# EAGLE design mysz (EAGLE 9.2.2)

## Sheet 1 of 5: uC
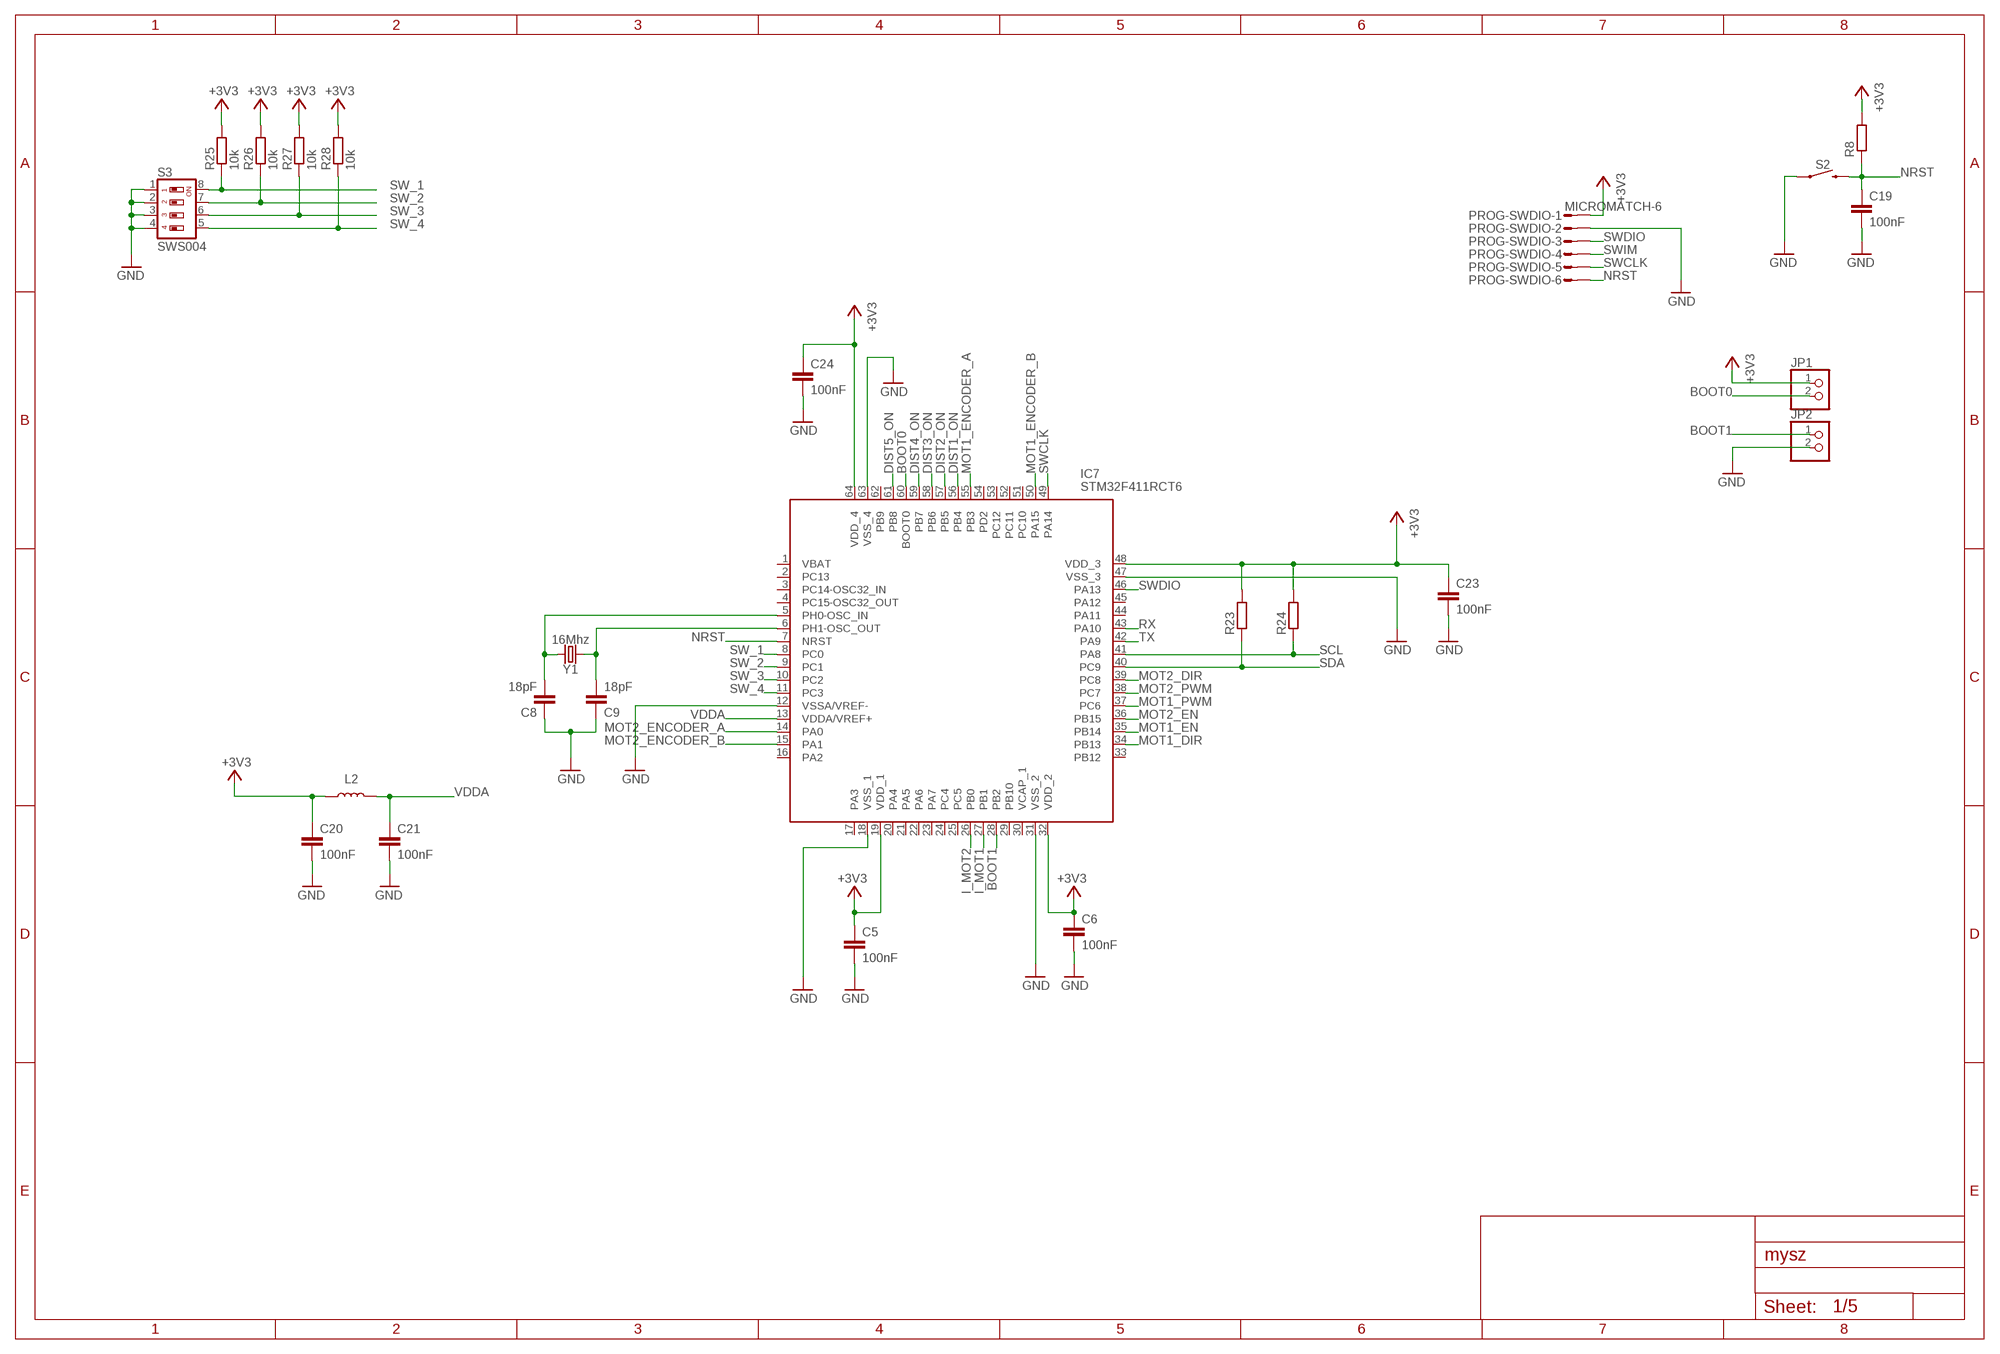
[diagram p0: schematic, sheet 1]

### Parts
C5  100nF  CAPACITOR_SMD_0603  [C0603K]
C6  100nF  CAPACITOR_SMD_0603  [C0603K]
C8  18pF  CAPACITOR_SMD_0603  [C0603K]
C9  18pF  CAPACITOR_SMD_0603  [C0603K]
C19  100nF  CAPACITOR_SMD_0603  [C0603K]
C20  100nF  CAPACITOR_SMD_0603  [C0603K]
C21  100nF  CAPACITOR_SMD_0603  [C0603K]
C23  100nF  CAPACITOR_SMD_0603  [C0603K]
C24  100nF  CAPACITOR_SMD_0603  [C0603K]
IC7  STM32F411RCT6  [QFP50P1200X1200X160-64N]
JP1  PINHD-1X2  [1X02]
JP2  PINHD-1X2  [1X02]
L2  INDUCTOR-0603  [R0603]
PROG-SWDIO  MICROMATCH-6  [MICROMATCH-6]
R8  RESISTOR_SMD_0603  [R0603]
R23  RESISTOR_SMD_0603  [R0603]
R24  RESISTOR_SMD_0603  [R0603]
R25  10k  RESISTOR_SMD_0603  [R0603]
R26  10k  RESISTOR_SMD_0603  [R0603]
R27  10k  RESISTOR_SMD_0603  [R0603]
R28  10k  RESISTOR_SMD_0603  [R0603]
S2  MOMENTARY-SWITCH-SPST-SMD-6.2MM_TALL  [TACTILE_SWITCH_SMD_6.2MM_TALL]
S3  SWS004  [SMS-004]
Y1  16Mhz  CRYSTAL_SMALL"  [CRYSTAL-SMD-5X3.2-4PAD]

### Nets
+3V3: C5.1 C6.1 C20.1 C23.1 C24.1 IC7.19(VDD_1) IC7.32(VDD_2) IC7.48(VDD_3) IC7.64(VDD_4) JP1.1 L2.1 PROG-SWDIO.1 R8.2 R23.2 R24.2 R25.2 R26.2 R27.2 R28.2 ; also sheet 2,3,4
BOOT0: IC7.60(BOOT0) JP1.2
BOOT1: IC7.28(PB2) JP2.1
DIST1_ON: IC7.56(PB4) ; also sheet 4
DIST2_ON: IC7.57(PB5) ; also sheet 4
DIST3_ON: IC7.58(PB6) ; also sheet 4
DIST4_ON: IC7.59(PB7) ; also sheet 4
DIST5_ON: IC7.61(PB8) ; also sheet 4
GND: C5.2 C6.2 C8.1 C9.1 C19.2 C20.2 C21.2 C23.2 C24.2 IC7.12(VSSA/VREF-) IC7.18(VSS_1) IC7.31(VSS_2) IC7.47(VSS_3) IC7.63(VSS_4) JP2.2 PROG-SWDIO.2 S2.A1 S2.A2 S3.1 S3.2 S3.3 S3.4 ; also sheet 2,3,4
I_MOT1: IC7.27(PB1) ; also sheet 3
I_MOT2: IC7.26(PB0) ; also sheet 3
MOT1_DIR: IC7.34(PB13) ; also sheet 3
MOT1_EN: IC7.35(PB14) ; also sheet 3
MOT1_ENCODER_A: IC7.55(PB3) ; also sheet 4
MOT1_ENCODER_B: IC7.50(PA15) ; also sheet 4
MOT1_PWM: IC7.37(PC6) ; also sheet 3
MOT2_DIR: IC7.39(PC8) ; also sheet 3
MOT2_EN: IC7.36(PB15) ; also sheet 3
MOT2_ENCODER_A: IC7.14(PA0) ; also sheet 4
MOT2_ENCODER_B: IC7.15(PA1) ; also sheet 4
MOT2_PWM: IC7.38(PC7) ; also sheet 3
NRST: C19.1 IC7.7(NRST) PROG-SWDIO.6 R8.1 S2.B1 S2.B2
RCC_OSC_IN: C8.2 IC7.5(PH0-OSC_IN) Y1.3
RCC_OSC_OUT: C9.2 IC7.6(PH1-OSC_OUT) Y1.1
RX: IC7.43(PA10)
SCL: IC7.41(PA8) R24.1 ; also sheet 4
SDA: IC7.40(PC9) R23.1 ; also sheet 4
SW_1: IC7.8(PC0) R25.1 S3.8
SW_2: IC7.9(PC1) R26.1 S3.7
SW_3: IC7.10(PC2) R27.1 S3.6
SW_4: IC7.11(PC3) R28.1 S3.5
SWCLK: IC7.49(PA14) PROG-SWDIO.5
SWDIO: IC7.46(PA13) PROG-SWDIO.3
SWIM: PROG-SWDIO.4
TX: IC7.42(PA9)
VDDA: C21.1 IC7.13(VDDA/VREF+) L2.2
Unconnected: IC7.1(VBAT) IC7.2(PC13) IC7.3(PC14-OSC32_IN) IC7.4(PC15-OSC32_OUT) IC7.16(PA2) IC7.17(PA3) IC7.20(PA4) IC7.21(PA5) IC7.22(PA6) IC7.23(PA7) IC7.24(PC4) IC7.25(PC5) IC7.29(PB10) IC7.30(VCAP_1) IC7.33(PB12) IC7.44(PA11) IC7.45(PA12) IC7.51(PC10) IC7.52(PC11) IC7.53(PC12) IC7.54(PD2) IC7.62(PB9)

## Sheet 2 of 5: Power
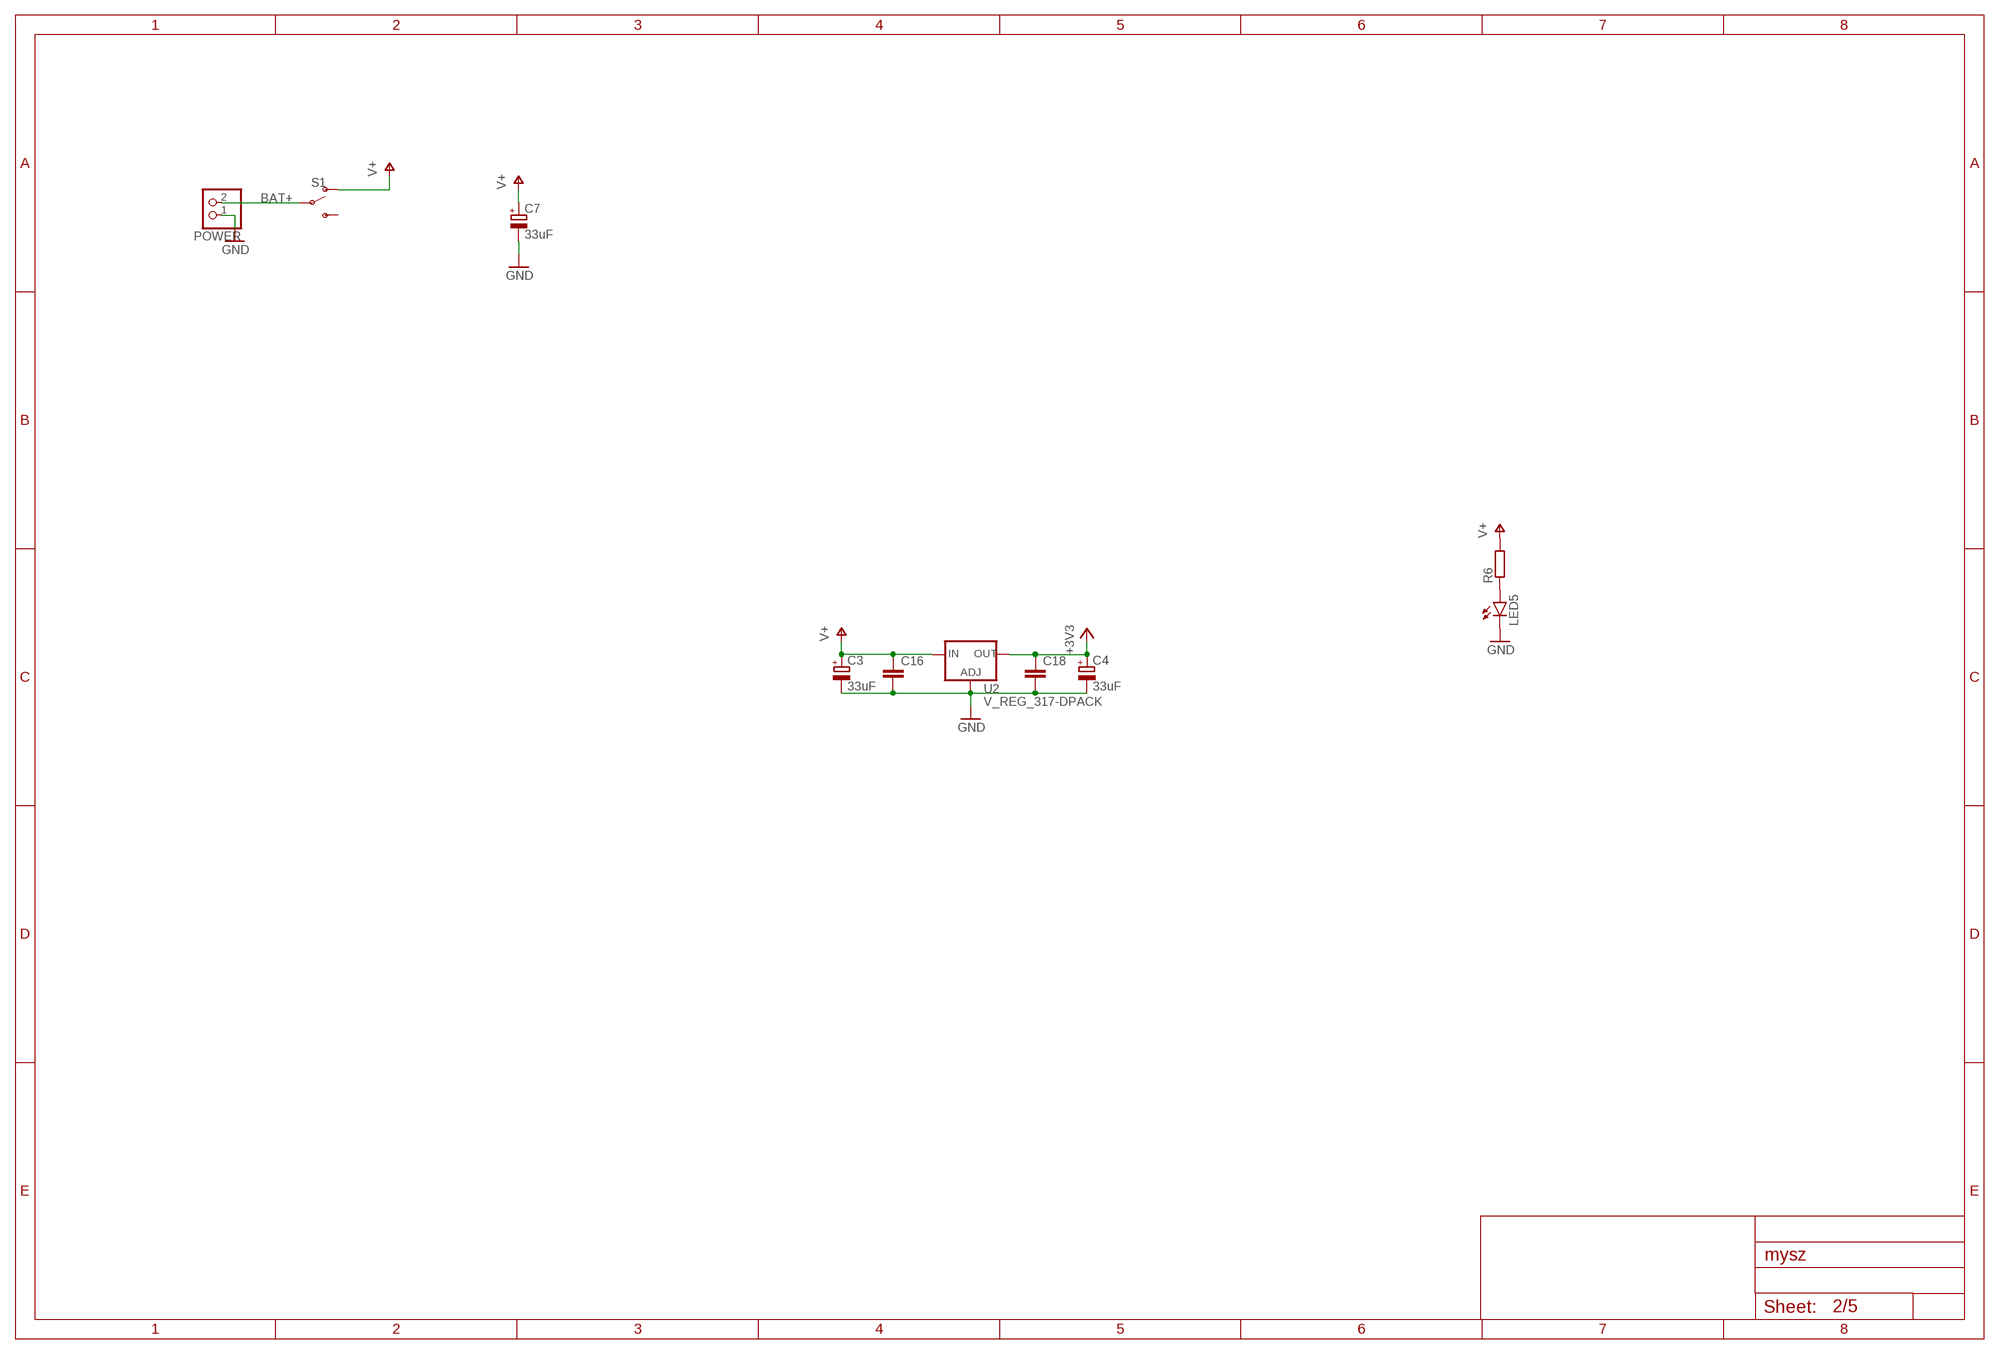
[diagram p1: schematic, sheet 2]

### Parts
C3  33uF  CPOL-EUC  [PANASONIC_C]
C4  33uF  CPOL-EUC  [PANASONIC_C]
C7  33uF  CPOL-EUC  [PANASONIC_C]
C16  CAPACITOR_SMD_0603  [C0603K]
C18  CAPACITOR_SMD_0603  [C0603K]
LED5  LEDCHIPLED_0603  [CHIPLED_0603]
POWER  PINHD-1X2  [1X02]
R6  RESISTOR_SMD_0603  [R0603]
S1  SWITCH-SPDT-PTH-11.6X4.0MM  [SWITCH_SPDT_PTH_11.6X4.0MM]
U2  V_REG_317-DPACK  [V-REG_DPACK]

### Nets
+3V3: C4.+ C18.1 U2.4(OUT) ; also sheet 1,3,4
BAT+: POWER.2 S1.2(P)
GND: C3.- C4.- C7.- C16.2 C18.2 LED5.C POWER.1 U2.1(ADJ) ; also sheet 1,3,4
N$7: LED5.A R6.1
V+: C3.+ C7.+ C16.1 R6.2 S1.1(O) U2.3(IN) ; also sheet 3
Unconnected: S1.3(S)

## Sheet 3 of 5: Motors
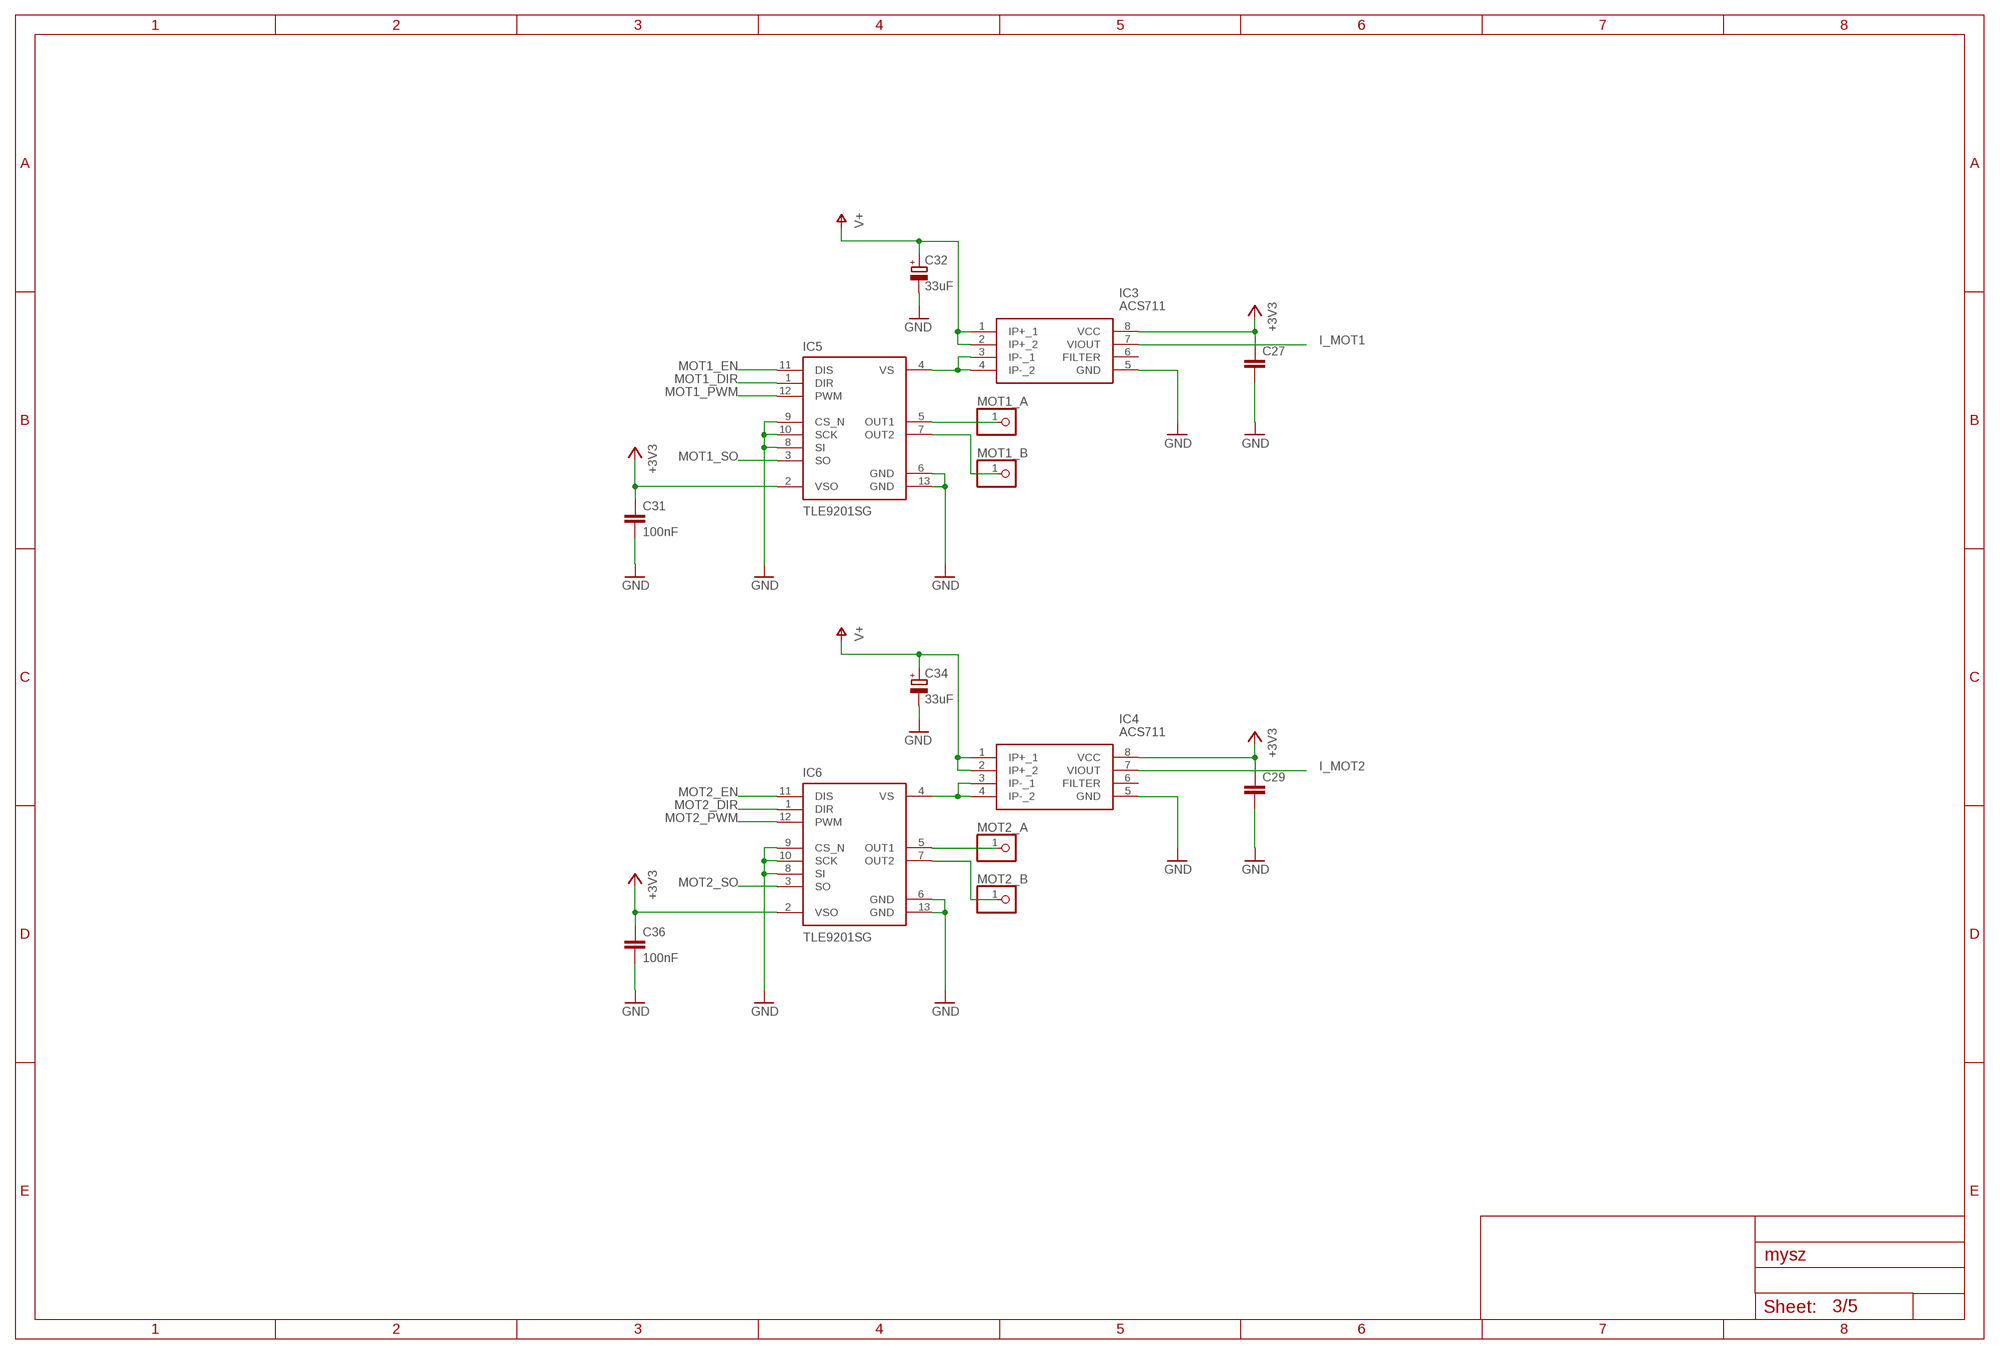
[diagram p2: schematic, sheet 3]

### Parts
C27  CAPACITOR_SMD_0603  [C0603K]
C29  CAPACITOR_SMD_0603  [C0603K]
C31  100nF  CAPACITOR_SMD_0603  [C0603K]
C32  33uF  CPOL-EUC  [PANASONIC_C]
C34  33uF  CPOL-EUC  [PANASONIC_C]
C36  100nF  CAPACITOR_SMD_0603  [C0603K]
IC3  ACS711  ACS712  [SOIC127P600X175-8N]
IC4  ACS711  ACS712  [SOIC127P600X175-8N]
IC5  TLE9201SG  [PG-DSO-12-9]
IC6  TLE9201SG  [PG-DSO-12-9]
MOT1_A  PINHD-1X1  [1X01]
MOT1_B  PINHD-1X1  [1X01]
MOT2_A  PINHD-1X1  [1X01]
MOT2_B  PINHD-1X1  [1X01]

### Nets
+3V3: C27.1 C29.1 C31.1 C36.1 IC3.8(VCC) IC4.8(VCC) IC5.2(VSO) IC6.2(VSO) ; also sheet 1,2,4
GND: C27.2 C29.2 C31.2 C32.- C34.- C36.2 IC3.5(GND) IC4.5(GND) IC5.6(GND) IC5.8(SI) IC5.9(CS_N) IC5.10(SCK) IC5.13(GND) IC6.6(GND) IC6.8(SI) IC6.9(CS_N) IC6.10(SCK) IC6.13(GND) ; also sheet 1,2,4
I_MOT1: IC3.7(VIOUT) ; also sheet 1
I_MOT2: IC4.7(VIOUT) ; also sheet 1
MOT1_A: IC5.5(OUT1) MOT1_A.1
MOT1_B: IC5.7(OUT2) MOT1_B.1
MOT1_DIR: IC5.1(DIR) ; also sheet 1
MOT1_EN: IC5.11(DIS) ; also sheet 1
MOT1_PWM: IC5.12(PWM) ; also sheet 1
MOT1_SO: IC5.3(SO)
MOT1_VS: IC3.3(IP-_1) IC3.4(IP-_2) IC5.4(VS)
MOT2_A: IC6.5(OUT1) MOT2_A.1
MOT2_B: IC6.7(OUT2) MOT2_B.1
MOT2_DIR: IC6.1(DIR) ; also sheet 1
MOT2_EN: IC6.11(DIS) ; also sheet 1
MOT2_PWM: IC6.12(PWM) ; also sheet 1
MOT2_SO: IC6.3(SO)
MOT2_VS: IC4.3(IP-_1) IC4.4(IP-_2) IC6.4(VS)
V+: C32.+ C34.+ IC3.1(IP+_1) IC3.2(IP+_2) IC4.1(IP+_1) IC4.2(IP+_2) ; also sheet 2
Unconnected: IC3.6(FILTER) IC4.6(FILTER)

## Sheet 4 of 5: Sensors
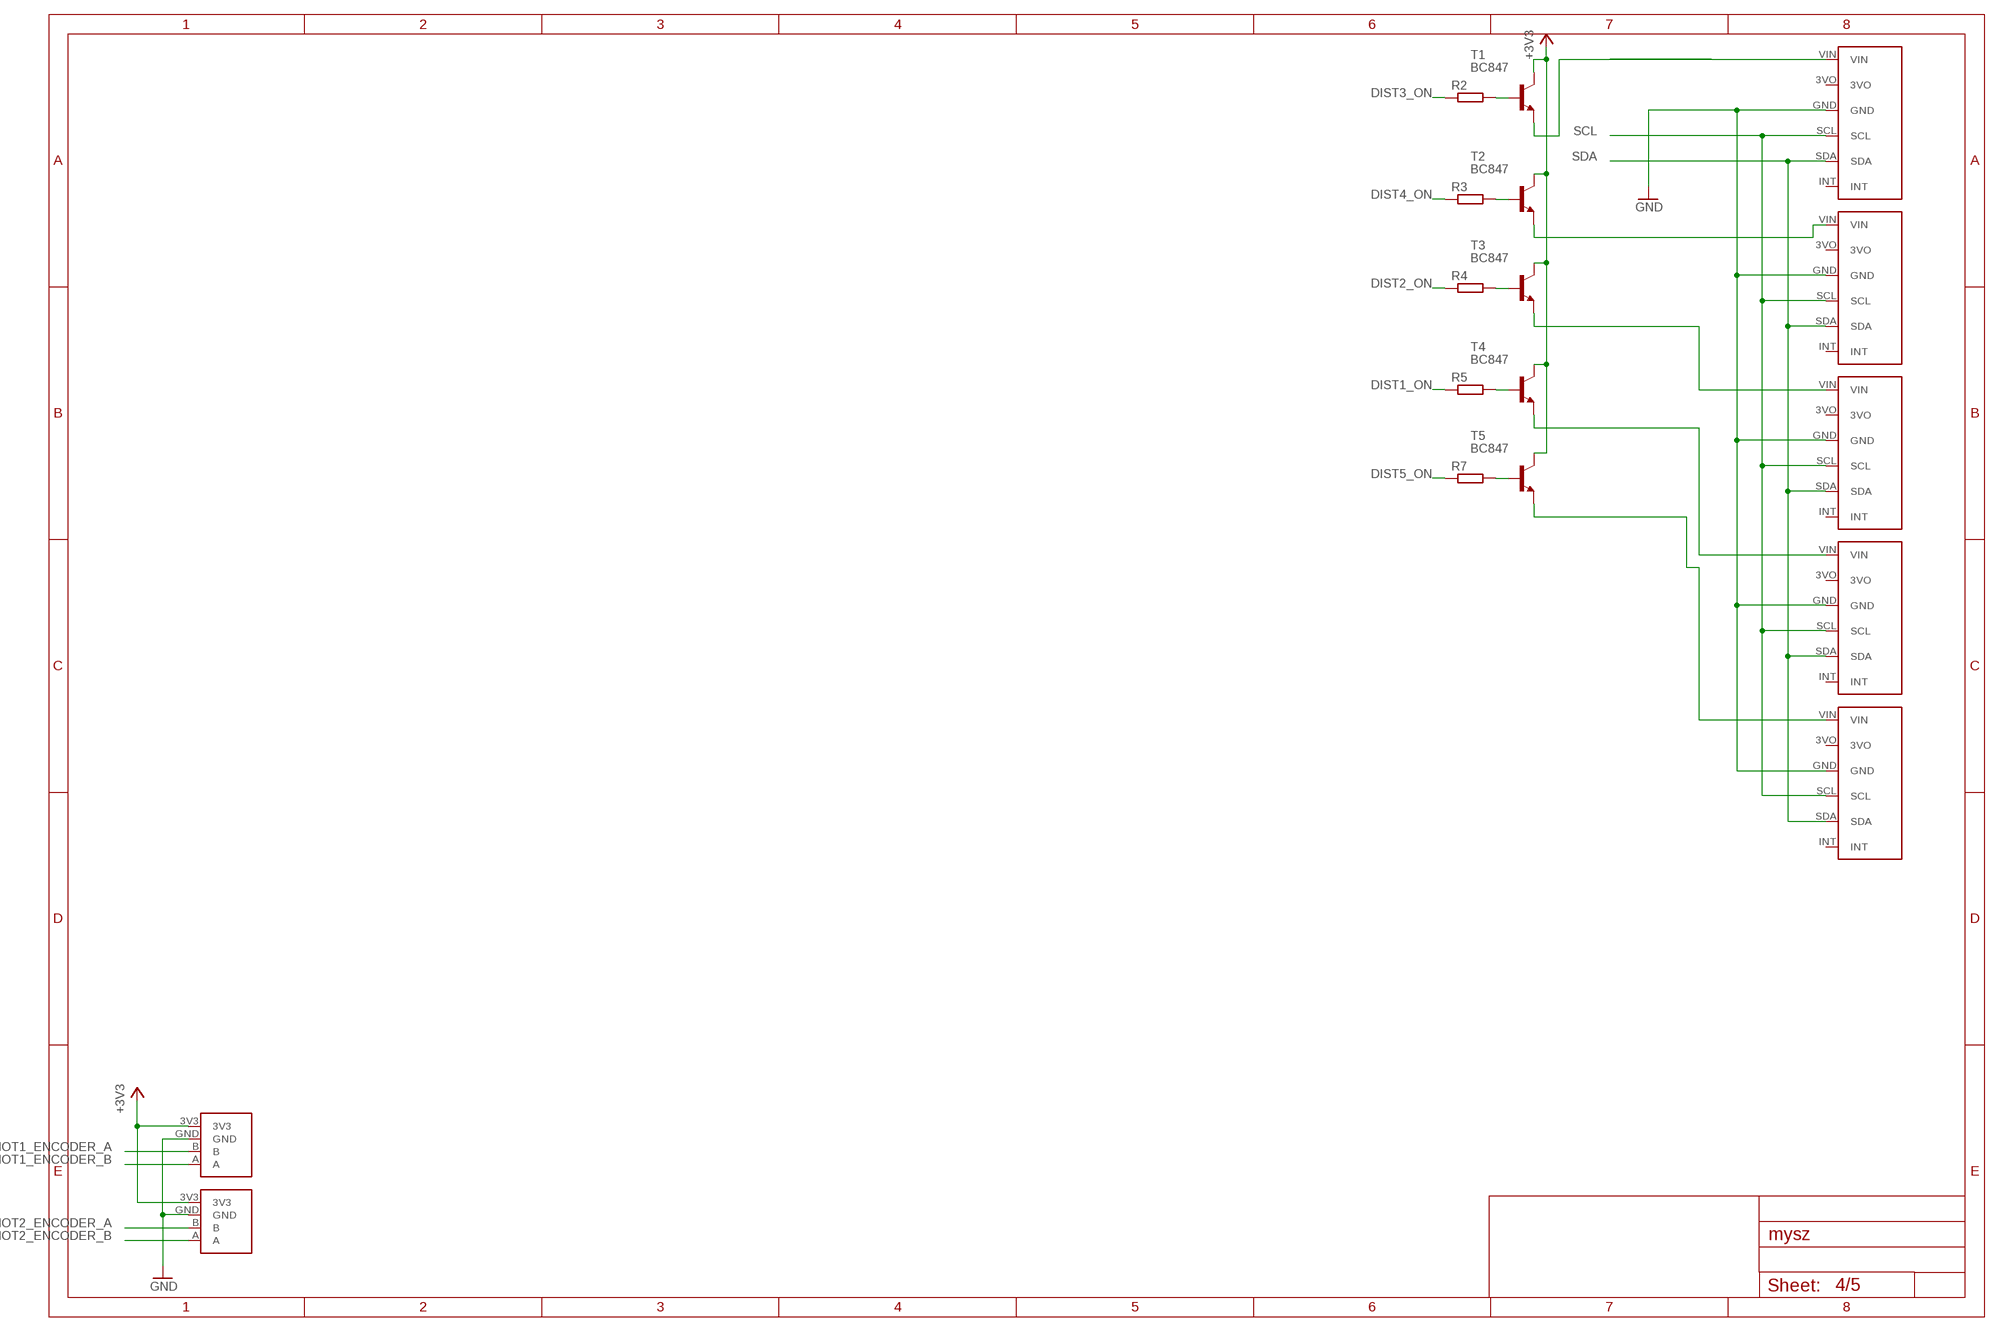
[diagram p3: schematic, sheet 4]

### Parts
R2  RESISTOR_SMD_0603  [R0603]
R3  RESISTOR_SMD_0603  [R0603]
R4  RESISTOR_SMD_0603  [R0603]
R5  RESISTOR_SMD_0603  [R0603]
R7  RESISTOR_SMD_0603  [R0603]
T1  BC847  [SOT23]
T2  BC847  [SOT23]
T3  BC847  [SOT23]
T4  BC847  [SOT23]
T5  BC847  [SOT23]
U$7  ADAFRUIT-VCNL4010  [ADAFRUIT-VCNL4010]
U$8  ADAFRUIT-VCNL4010  [ADAFRUIT-VCNL4010]
U$9  ADAFRUIT-VCNL4010  [ADAFRUIT-VCNL4010]
U$10  ADAFRUIT-VCNL4010  [ADAFRUIT-VCNL4010]
U$11  ADAFRUIT-VCNL4010  [ADAFRUIT-VCNL4010]
U$13  PRIV-AS5040  [PRIV-AS5040]
U$14  PRIV-AS5040  [PRIV-AS5040]

### Nets
+3V3: T1.3(C) T2.3(C) T3.3(C) T4.3(C) T5.3(C) U$13.3V3 U$14.3V3 ; also sheet 1,2,3
DIST1_ON: R5.1 ; also sheet 1
DIST2_ON: R4.1 ; also sheet 1
DIST3_ON: R2.1 ; also sheet 1
DIST4_ON: R3.1 ; also sheet 1
DIST5_ON: R7.1 ; also sheet 1
GND: U$7.GND U$8.GND U$9.GND U$10.GND U$11.GND U$13.GND U$14.GND ; also sheet 1,2,3
MOT1_ENCODER_A: U$14.B ; also sheet 1
MOT1_ENCODER_B: U$14.A ; also sheet 1
MOT2_ENCODER_A: U$13.B ; also sheet 1
MOT2_ENCODER_B: U$13.A ; also sheet 1
N$2: R2.2 T1.1(B)
N$3: R3.2 T2.1(B)
N$4: R4.2 T3.1(B)
N$5: R5.2 T4.1(B)
N$6: R7.2 T5.1(B)
N$8: T2.2(E) U$8.VIN
N$9: T1.2(E) U$7.VIN
N$11: T3.2(E) U$9.VIN
N$12: T4.2(E) U$10.VIN
N$13: T5.2(E) U$11.VIN
SCL: U$7.SCL U$8.SCL U$9.SCL U$10.SCL U$11.SCL ; also sheet 1
SDA: U$7.SDA U$8.SDA U$9.SDA U$10.SDA U$11.SDA ; also sheet 1
Unconnected: U$7.3VO U$7.INT U$8.3VO U$8.INT U$9.3VO U$9.INT U$10.3VO U$10.INT U$11.3VO U$11.INT

## Sheet 5 of 5: Display and bluetooth
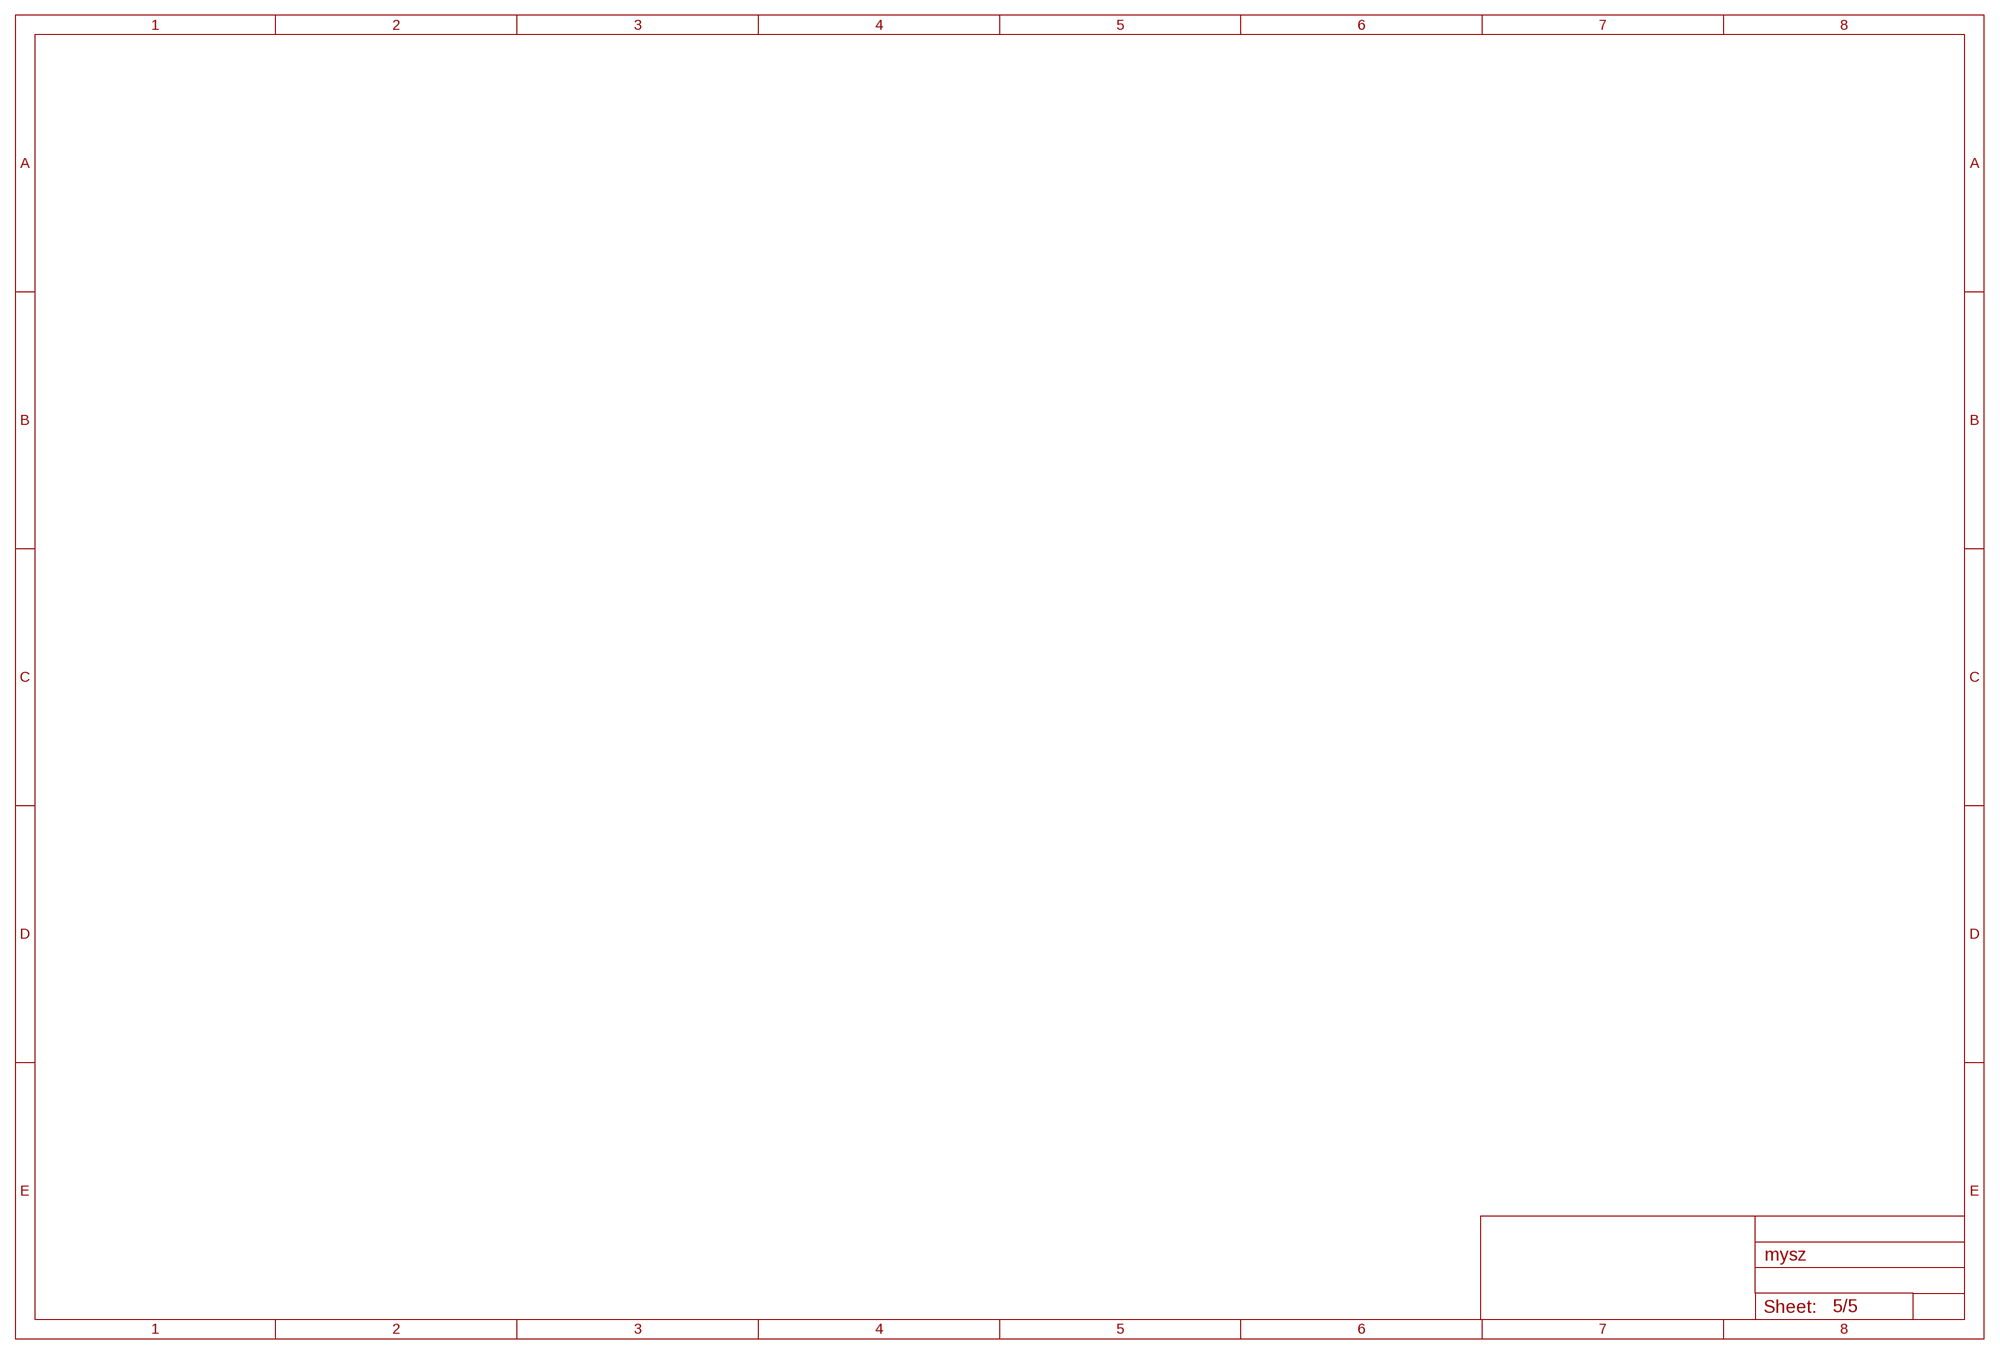
[diagram p4: schematic, sheet 5]

## Library data of the parts
C3 C4 C7 C32 C34 = Kell Ideas:CPOL-EU: POLARIZED CAPACITOR, European symbol; SPICEPREFIX: C
C5 C6 C8 C9 C16 C18-C21 C23 C24 C27 C29 C31 C36 = Kell Ideas:CAPACITOR_SMD
IC3 IC4 = Kell Ideas:ACS712: Fully Integrated, Hall Effect-Based Linear Current Sensor IC with 2.1 kVRMS Isolation and a Low-Resistance Current Conductor Source: Datasheet; ARROW_PART_NUMBER: ACS712; DESCRIPTION: Fully Integrated, Hall Effect-Based Linear Current Sensor IC with 2.1 kVRMS Isolation and a Low-Resistance Current Conductor; HEIGHT: 1.75mm; MANUFACTURER_NAME: Allegro Microsystems; MANUFACTURER_PART_NUMBER: ACS712
IC5 IC6 = Kell Ideas:TLE9201SG: Infineon TLE9201SG, BLDC Motor Driver IC, 28 V 6A 12-Pin, DSO-12-17 Source: Datasheet; ARROW_PART_NUMBER: TLE9201SG; ARROW_PRICE/STOCK: http://uk.rs-online.com/web/p/products/1661194; DESCRIPTION: Infineon TLE9201SG, BLDC Motor Driver IC, 28 V 6A 12-Pin, DSO-12-17; HEIGHT: mm; MANUFACTURER_NAME: Infineon; MANUFACTURER_PART_NUMBER: TLE9201SG; RS_PART_NUMBER: 1661194; RS_PRICE/STOCK: http://uk.rs-online.com/web/p/products/1661194
IC7 = Kell Ideas:STM32F411RCT6: STMICROELECTRONICS - STM32F411RCT6 - MCU, 32BIT, CORTEX-M4, 100MHZ, LQFP-64 Source: Datasheet; ARROW_PART_NUMBER: STM32F411RCT6; ARROW_PRICE-STOCK: https://www.arrow.com/en/products/stm32f411rct6/stmicroelectronics; DESCRIPTION: STMICROELECTRONICS - STM32F411RCT6 - MCU, 32BIT, CORTEX-M4, 100MHZ, LQFP-64; HEIGHT: 1.6mm; MANUFACTURER_NAME: STMicroelectronics; MANUFACTURER_PART_NUMBER: STM32F411RCT6
JP1 JP2 POWER = pinhead:PINHD-1X2: PIN HEADER
L2 = Kell Ideas:INDUCTOR: Inductors Resist changes in electrical current. Basically a coil of wire. SparkFun Products: SparkFun Load Cell Amplifier - HX711 IOIO-OTG - V2.2
LED5 = led:LED: LED OSRAM: - CHIPLED LG R971, LG N971, LY N971, LG Q971, LY Q971, LO R971, LY R971 LH N974, LH R974 LS Q976, LO Q976, LY Q976 LO Q996 - Hyper CHIPLED LW Q18S LB Q993, LB Q99A, LB R99A - SideLED LS A670, LO A670, LY A670, LG A670, LP A670 LB A673, LV A673, LT A673, LW A673 LH A674 LY A675 LS A676, LA A676, LO A676, LY A676, LW A676 LS A679, LY A679, LG A679 - Hyper Micro SIDELED® LS Y876, LA Y876, LO Y876, LY Y876 LT Y87S - SmartLED LW L88C, LW L88S LB L89C, LB L89S, LG L890 LS L89K, LO L89K, LY L89K LS L896, LA L896, LO L896, LY L896 - TOPLED LS T670, LO T670, LY T670, LG T670, LP T670 LSG T670, LSP T670, LSY T670, LOP T670, LYG T670 LG T671, LOG T671, LSG T671 LB T673, LV T673, LT T673, LW T673 LH T674 LS T676, LA T676, LO T676, LY T676, LB T676, LH T676, LSB T676, LW T676 LB T67C, LV T67C, LT T67C, LS T67K, LO T67K, LY T67K, LW E67C LS E67B, LA E67B, LO E67B, LY E67B, LB E67C, LV E67C, LT E67C LW T67C LS T679, LY T679, LG T679 LS T770, LO T770, LY T770, LG T770, LP T770 LB T773, LV T773, LT T773, LW T773 LH T774 LS E675, LA E675, LY E675, LS T675 LS T776, LA T776, LO T776, LY T776, LB T776 LHGB T686 LT T68C, LB T68C - Hyper Mini TOPLED® LB M676 - Mini TOPLED Santana® LG M470 LS M47K, LO M47K, LY M47K Source: http://www.osram.convergy.de LUXEON: - LUMILED® LXK2-PW12-R00, LXK2-PW12-S00, LXK2-PW14-U00, LXK2-PW14-V00 LXK2-PM12-R00, LXK2-PM12-S00, LXK2-PM14-U00 LXK2-PE12-Q00, LXK2-PE12-R00, LXK2-PE12-S00, LXK2-PE14-T00, LXK2-PE14-U00 LXK2-PB12-K00, LXK2-PB12-L00, LXK2-PB12-M00, LXK2-PB14-N00, LXK2-PB14-P00, LXK2-PB14-Q00 LXK2-PR12-L00, LXK2-PR12-M00, LXK2-PR14-Q00, LXK2-PR14-R00 LXK2-PD12-Q00, LXK2-PD12-R00, LXK2-PD12-S00 LXK2-PH12-R00, LXK2-PH12-S00 LXK2-PL12-P00, LXK2-PL12-Q00, LXK2-PL12-R00 Source: www.luxeon.com KINGBRIGHT: KA-3528ASYC Source: www.kingbright.com
MOT1_A MOT1_B MOT2_A MOT2_B = pinhead:PINHD-1X1: PIN HEADER
PROG-SWDIO = con-amp-micromatch:MICROMATCH-6: MicroMaTch 6 7-215464-6 / 0-215464-6 Drawing Number C-215464 DDEController.pdf; MPN: 7-215464-6; OC_FARNELL: 3784630; OC_NEWARK: 19R8125
R2-R8 R23-R28 = Kell Ideas:RESISTOR_SMD
S1 = SparkFun-Switches:SWITCH-SPDT: Single Pole, Double Throw (SPDT) Switch Single-pole, double-throw (SPDT) switch. Variant Overview SMD-AYZ0202 Surface Mount DPDT Switch (COM-00597) Used on e.g. LilyPad Arduino USB - ATmega32U4 Board PTH-11.6X4.0MM SPDT Mini Power Switch (COM-00102) Used on e.g. SparkFun Simon Says - Through-Hole Soldering Kit (KIT-10547) PTH-11.6X4.0MM-KIT KIT version of SPDT Mini Power Switch - Simplifies soldering by removing tStop of switch pins - only one side can be soldered. PTH-11.6X4.0MM-LOCK LOCK version of SPDT Mini Power Switch - Offset pins hold switch in place for easier soldering. SMD-RIGHT-ANGLE Surface Mount Right Angle Switch (COM-10860) Used on e.g. SparkFun ESP8266 Thing; PROD_ID: SWCH-08261; SF_SKU: COM-00102
S2 = Kell Ideas:MOMENTARY-SWITCH-SPST: Momentary Switch (Pushbutton) - SPST Normally-open (NO) SPST momentary switches (buttons, pushbuttons). Variants PTH-12MM - 12mm square, through-hole Momentary Pushbutton Switch - 12mm Square (COM-09190) PTH-6.0MM, PTH-6.0MM-KIT - 6.0mm square, through-hole Mini Pushbutton Switch (COM-00097) KIT package intended for soldering kit's - only one side of pads' copper is exposed. PTH-RIGHT-ANGLE-KIT - Right-angle, through-hole Right Angle Tactile Button - Used on SparkFun BigTime Watch Kit SMD-12MM - 12mm square, surface-mount Tactile Button - SMD (12mm) (COM-12993) Used on SparkFun PicoBoard SMD-4.5MM - 4.5mm Square Trackball Switch Used on SparkFun Blackberry Trackballer Breakout SMD-4.6MMX2.8MM - 4.60mm x 2.80mm, surface mount Used on SparkFun SAMD21 Mini Breakout SMD-5.2MM, SMD-5.2-REDUNDANT - 5.2mm square, surface-mount Mini Pushbutton Switch - SMD (COM-08720) Used on Arduino Pro Mini REDUNDANT package connects both switch circuits together SMD-6.0X3.5MM - 6.0 x 3.5mm, surface mount Momentary Reset Switch SMD (COM-08229) SMD-6.2MM-TALL - 6.2mm square, surface mount Tactile Button - SMD (6mm) Used on SparkFun Digital Sandbox SMD-RIGHT-ANGLE - Right-angle, surface mount Used on SparkFun Block for Intel® Edison - Arduino
S3 = Kell Ideas:SWS004: SMD Dip Switch 4 pol.
T1-T5 = transistor:BC847: NPN TRANSISTOR
U2 = Kell Ideas:V_REG_317: Voltage Regulator Standard LM317 adjustable voltage regulator. AOI (Adjust Output Input). Google 'LM317 Calculator' for easy to use app to get the two resistor values needed. 240/720 for 5V output. 240/390 for 3.3V output. Spark Fun Electronics SKU : COM-00527
U$7-U$11 = Kell Ideas:ADAFRUIT-VCNL4010
U$13 U$14 = Kell Ideas:PRIV-AS5040
Y1 = Kell Ideas:CRYSTAL_SMALL: 12.0MHz Crystal Frequency: 12.0MHz Frequency Tolerance: ±20ppm Load Capacitance: 18pF SparkFun Products: SparkFun Logomatic <https://www.sparkfun.com/products/12772> Pocket AVR Programmer <https://www.sparkfun.com/products/9825>; PROD_ID: XTAL-08297; VALUE: 12MHz

## Board
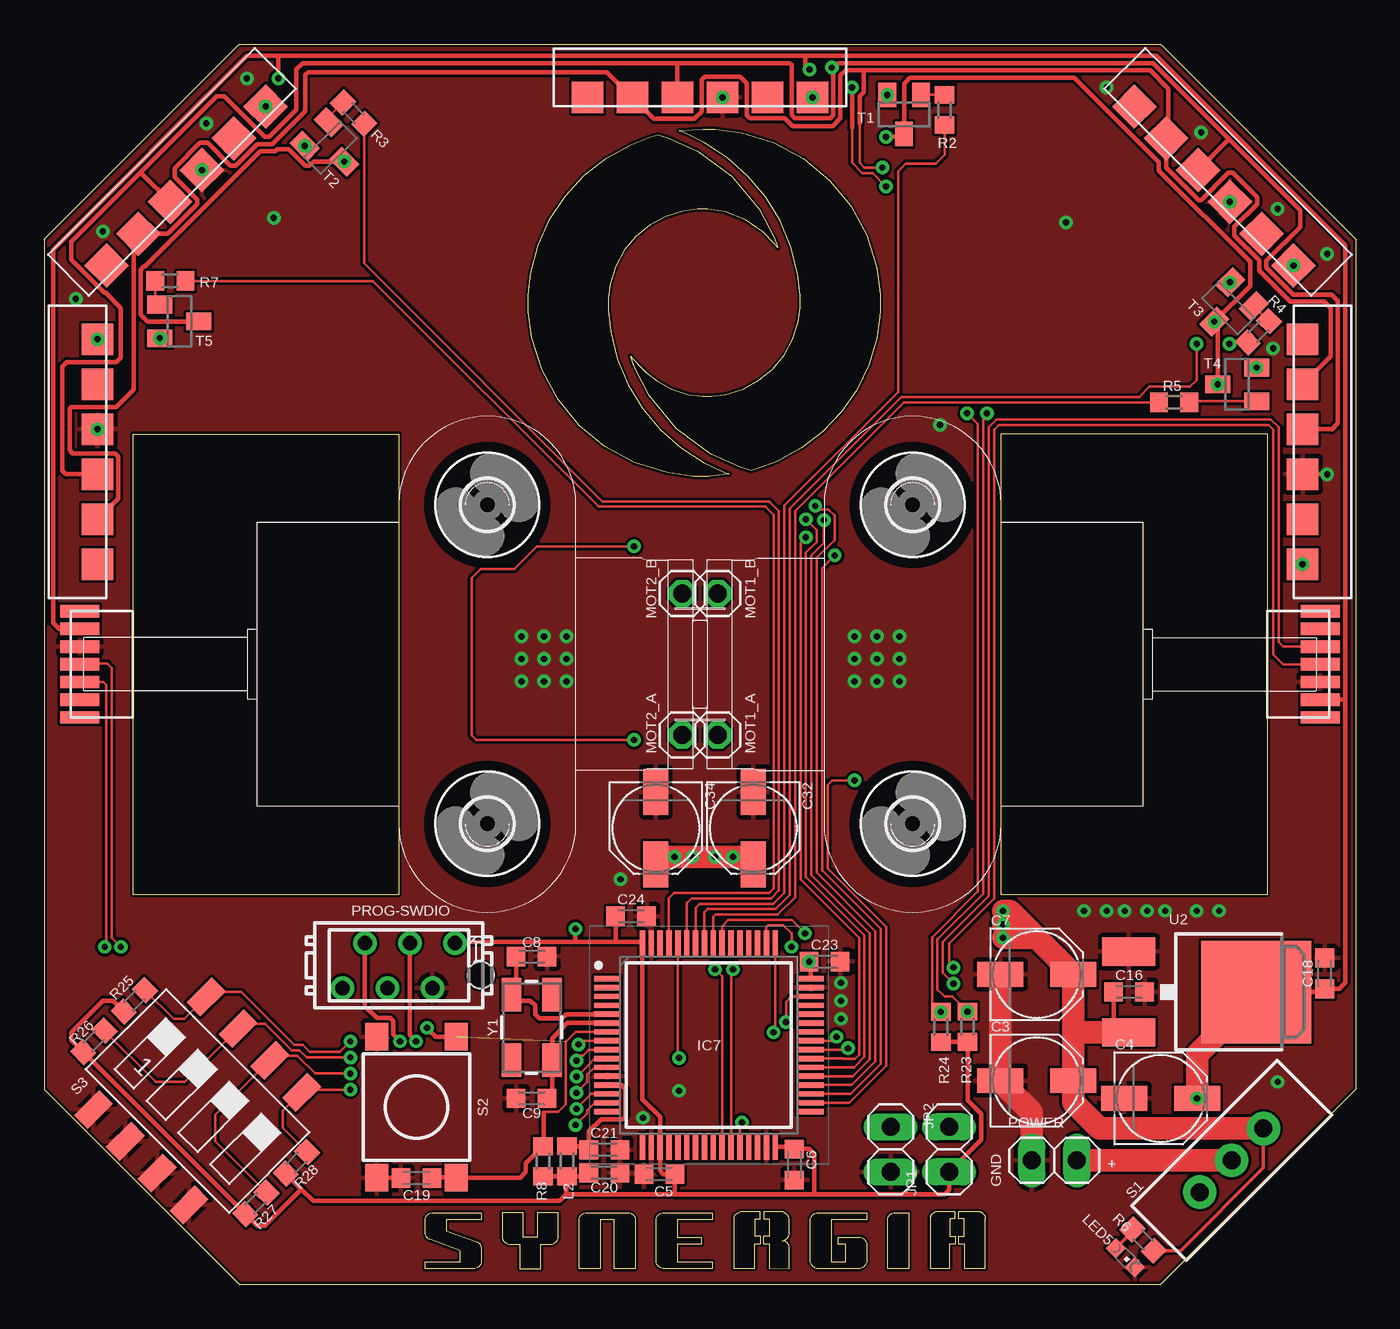
[diagram p5: board, top side]
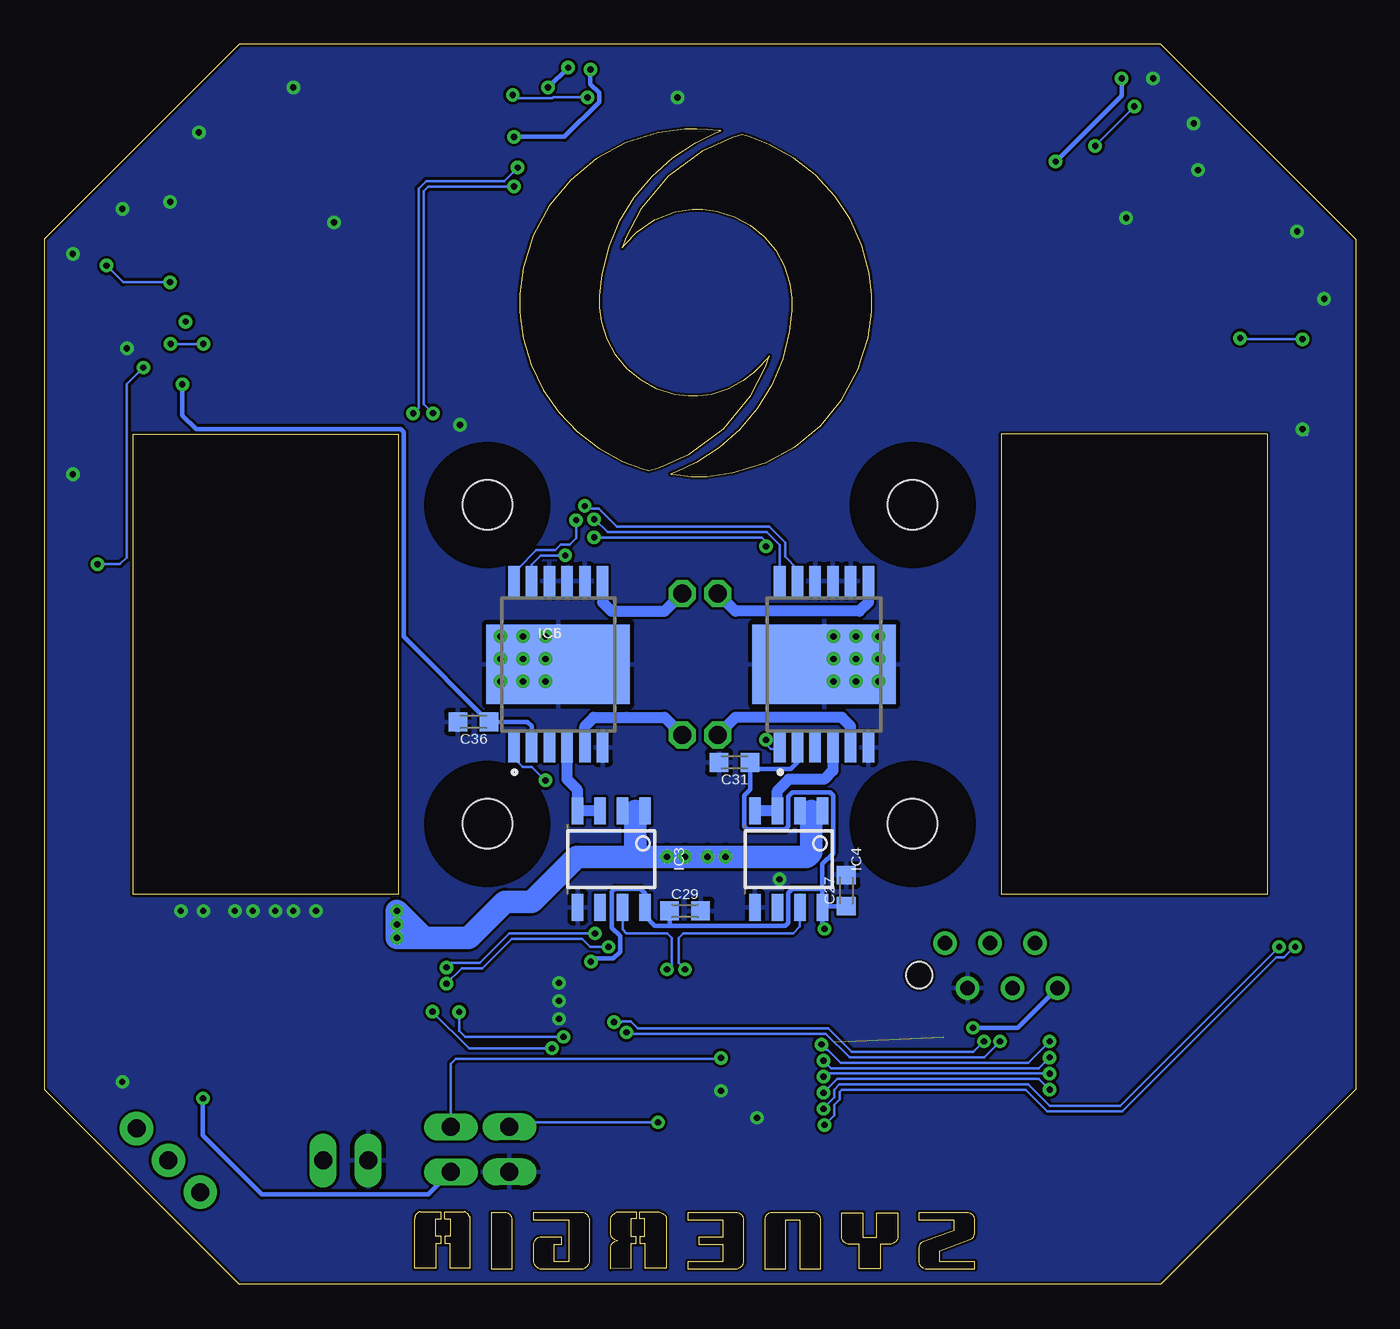
[diagram p6: board, bottom side, seen from below]

Size 74 x 70 mm. Coordinates in mm from the lower left corner, seen from the top.
Outline: 311 segments
Copper layers (1*16): Top 0.035mm / dielectric 1.5mm / Bottom 0.035mm
Design rules "default *": minimum track width 6mil, minimum drill 0.35mm, track to track 6mil, track to pad 6mil, pad to pad 6mil, via to via 6mil, smd to smd 6mil, copper to edge 6mil, drill to drill 6mil, minimum pad ring 10mil, minimum via ring 8mil, stop-mask expansion 4mil, vias tented up to drill 15mil, thermal gap 10mil

### Footprints (pad centres in the part's own frame; a part is rotated, then mirrored left to right if it is on the bottom)
PANASONIC_C = smd 2.6 x 1.4: + 2.05,0; - -2.05,0
C0603K = smd 1.05 x 1.08: 1 -0.875,0; 2 0.875,0
SOIC127P600X175-8N = smd 1.525 x 0.65: 1 -2.712,1.905; 2 -2.712,0.635; 3 -2.712,-0.635; 4 -2.712,-1.905; 5 2.712,-1.905; 6 2.712,-0.635; 7 2.712,0.635; 8 2.712,1.905
PG-DSO-12-9 = smd 0.65 x 1.67: 1 -2.5,-4.7; 2 -1.5,-4.7; 3 -0.5,-4.7; 4 0.5,-4.7; 5 1.5,-4.7; 6 2.5,-4.7; 7 2.5,4.7; 8 1.5,4.7; 9 0.5,4.7; 10 -0.5,4.7; 11 -1.5,4.7; 12 -2.5,4.7 | smd 8.1 x 4.5: 13 0,0
QFP50P1200X1200X160-64N = smd 1.475 x 0.3: 1 -5.738,3.75; 2 -5.738,3.25; 3 -5.738,2.75; 4 -5.738,2.25; 5 -5.738,1.75; 6 -5.738,1.25; 7 -5.738,0.75; 8 -5.738,0.25; 9 -5.738,-0.25; 10 -5.738,-0.75; 11 -5.738,-1.25; 12 -5.738,-1.75; 13 -5.738,-2.25; 14 -5.738,-2.75; 15 -5.738,-3.25; 16 -5.738,-3.75; 33 5.738,-3.75; 34 5.738,-3.25; 35 5.738,-2.75; 36 5.738,-2.25; 37 5.738,-1.75; 38 5.738,-1.25; 39 5.738,-0.75; 40 5.738,-0.25; 41 5.738,0.25; 42 5.738,0.75; 43 5.738,1.25; 44 5.738,1.75; 45 5.738,2.25; 46 5.738,2.75; 47 5.738,3.25; 48 5.738,3.75 | smd 0.3 x 1.475: 17 -3.75,-5.738; 18 -3.25,-5.738; 19 -2.75,-5.738; 20 -2.25,-5.738; 21 -1.75,-5.738; 22 -1.25,-5.738; 23 -0.75,-5.738; 24 -0.25,-5.738; 25 0.25,-5.738; 26 0.75,-5.738; 27 1.25,-5.738; 28 1.75,-5.738; 29 2.25,-5.738; 30 2.75,-5.738; 31 3.25,-5.738; 32 3.75,-5.738; 49 3.75,5.738; 50 3.25,5.738; 51 2.75,5.738; 52 2.25,5.738; 53 1.75,5.738; 54 1.25,5.738; 55 0.75,5.738; 56 0.25,5.738; 57 -0.25,5.738; 58 -0.75,5.738; 59 -1.25,5.738; 60 -1.75,5.738; 61 -2.25,5.738; 62 -2.75,5.738; 63 -3.25,5.738; 64 -3.75,5.738
1X02 = drill 1.016 long: 1 -1.27,0; 2 1.27,0
R0603 = smd 1 x 1.1: 1 -0.85,0; 2 0.85,0
CHIPLED_0603 = smd 0.8 x 0.8: A 0,-0.75; C 0,0.75
1X01 = drill 1.016 octagon: 1 0,0
MICROMATCH-6 = drill 0.813: 1 3.175,1.27; 2 1.905,-1.27; 3 0.635,1.27; 4 -0.635,-1.27; 5 -1.905,1.27; 6 -3.175,-1.27 | hole 1.5: 4.63,-0.55
SWITCH_SPDT_PTH_11.6X4.0MM = drill 1.016 pad 1.88: 1 0,2.54; 2 0,0; 3 0,-2.54
TACTILE_SWITCH_SMD_6.2MM_TALL = smd 1.55 x 1.3: A1 -3.975,-2.25; A2 3.975,-2.25; B1 -3.975,2.25; B2 3.975,2.25
SMS-004 = smd 1.092 x 2.007: 1 -3.81,-4.496; 2 -1.27,-4.496; 3 1.27,-4.496; 4 3.81,-4.496; 5 3.81,4.496; 6 1.27,4.496; 7 -1.27,4.496; 8 -3.81,4.496
SOT23 = smd 1 x 1.4: 1 -0.95,-1.1; 2 0.95,-1.1; 3 0,1.1
V-REG_DPACK = smd 1.6 x 3: 1 -2.28,-4.8; 3 2.28,-4.8 | smd 5.8 x 6.2: 4 0,2.38
2,8 = hole 2.8: 0,0
ADAFRUIT-VCNL4010 = smd 1.778 x 1.778: 3VO 0,3.81; GND 0,1.27; INT 0,-6.35; SCL 0,-1.27; SDA 0,-3.81; VIN 0,6.35
PRIV-AS5040 = smd 2.2 x 0.7: 3V3 0,2; A 0,-1; B 0,0; GND 0,1; P$4 0,3; P$6 0,-2; P$7 0,-3
CRYSTAL-SMD-5X3.2-4PAD = smd 1.9 x 1.1: 1 -1.85,-1.15; 2 1.85,-1.15; 3 1.85,1.15; 4 -1.85,1.15

### Placement (x,y rotation side)
C3  56,11.5 0 top
C4  63,10.5 0 top
C5  34.7,6.21 180 top
C6  42.32,6.76 270 top
C7  56,17.5 0 top
C8  27.5,18.5 180 top
C9  27.5,10.5 0 top
C16  61.21,16.51 0 top
C18  72.25,17.55 90 top
C19  21,6 180 top
C20  31.6,6.3 0 top
C21  31.6,7.6 0 top
C23  44.04,18.22 0 top
C24  33.11,20.78 0 top
C27  28.74,22.22 90 bottom
C29  37.85,21.08 0 bottom
C31  35.05,29.46 180 bottom
C32  40,25.75 270 top
C34  34.5,25.75 270 top
C36  49.78,31.75 180 bottom
IC3  42,24 270 bottom
IC4  32,24 270 bottom
IC5  45,35 0 bottom
IC6  30,35 0 bottom
IC7  37.5,13.5 0 top
JP1  51.05,7.62 90 top
JP2  47.75,7.62 270 top
L2  29.49,6.95 90 top
LED5  61,1.5 225 top
MOT1_A  38,31 0 top
MOT1_B  38,39 0 top
MOT2_A  36,31 0 top
MOT2_B  36,39 0 top
POWER  57,7 0 top
PROG-SWDIO  20,18 0 top
R2  50.8,66.29 90 top
R3  17.45,66.11 135 top
R4  68.51,53.77 45 top
R5  63.75,49.78 0 top
R6  62,2.5 315 top
R7  7.11,56.64 180 top
R8  28.13,6.94 270 top
R23  52.1,14.54 270 top
R24  50.59,14.52 270 top
R25  5.08,16 225 top
R26  2.79,13.72 225 top
R27  11.94,4.57 225 top
R28  14.22,6.86 225 top
S1  67,7 315 top
S2  21,10 270 top
S3  8.65,10.35 315 top
T1  48.51,66.04 180 top
T2  16.15,64.16 225 top
T3  66.8,55.12 135 top
T4  67.31,50.8 90 top
T5  7.62,54.36 270 top
U2  66,16.5 270 top
U$1  [POLOLU_SINGLE_SHAFT]  12,43 270 top
U$2  [POLOLU_SINGLE_SHAFT]  62,27 90 top
U$3  [2,8]  25,44 0 top
U$4  [2,8]  25,26 0 top
U$5  [2,8]  49,26 0 top
U$6  [2,8]  49,44 0 top
U$7  37,67 270 top
U$8  8,62 315 top
U$9  66,62 225 top
U$10  71,47 180 top
U$11  3,47 0 top
U$13  2,35 0 top
U$14  72,35 180 top
Y1  27.5,14.5 90 top

### Tracks (layer width: path | path; a pad name or v marks a point on that pad's centre or on a via)
+3V3  (via drill 0.35)
  Top 0.152: 2.07,13.24 R26.2 | 11.46,3.84 R27.2
  Top 0.254: 13.21,69.34 11.43,69.34 0.51,58.42 0.51,37.34 0.85,37 U$13.3V3 | 13.21,69.34 42.93,69.34 | 42.93,69.34 62.74,69.34 73.41,58.67 73.41,33.02 | U2.4 68.58,16.5 72.07,16.5 C18.1 73.06,16.68 73.41,17.02 73.41,33.02 | PROG-SWDIO.1 23.22,19.32 29.97,19.32 | 32.26,19.32 33.67,19.32 IC7.64 33.75,10.45 34.75,9.45 IC7.19 34.75,6.4 34.93,6.21 C5.1 35.58,5.1 35.56,5.08 | 32.26,19.32 29.97,19.32 | U$14.3V3 73.39,33 73.41,33.02 | C24.1 32.24,19.34 32.26,19.32 | L2.1 30.53,6.1 C20.1 | R8.2 28.14,6.1 L2.1 | IC7.32 42.2,7.76 C6.1 43.16,7.64 43.43,7.37 43.43,5.08 | C23.1 43.24,18.14 IC7.48 | L2.1 29.46,6.08 29.46,5.08 | 35.56,5.08 29.46,5.08 | 35.56,5.08 43.43,5.08 | 43.43,5.08 50.8,5.08 51.05,5.33 JP1.1 52.86,8.15 52.86,9.63 52.1,10.39 R23.2 50.6,13.69 R24.2 | 11.46,3.84 12.01,3.3 12.45,3.3 14.51,5.37 | 14.51,5.37 15.16,4.72 29.1,4.72 29.46,5.08 | 14.51,5.37 R28.2 | R27.2 R26.2 | R25.2 3.88,16 3.3,16 1.52,14.22 1.52,13.78 2.07,13.24 | v29.97,20.07 29.97,19.32 | T4.3 66.21,54.15 T3.3 68.04,56.35 68.04,57.74 62.9,62.87 62.9,63.34 58.12,68.12 48.85,68.12 48.51,67.78 T1.3 48.34,64.77 v47.5,64.77 | 42.93,69.34 42.93,68.83 v43.18,68.58 | 13.21,69.34 v13.21,68.07 | T2.3 15.2,63.38 14.96,63.13 14.73,63.13 13.79,64.08 13.16,64.08 13.04,63.96 12.18,63.96 5.7,57.47 5.65,57.47 5.45,57.28 5.45,54.74 5.84,54.36 T5.3
  Top 1.27: C4.+ 65.05,12.97 68.58,16.5
  Bottom 0.254: JP1.1 52.32,5.08 61.72,5.08 65.05,8.41 C4.+ | IC4.8 30.09,20.19 v29.97,20.07 | IC4.8 30.09,22.35 | 38.61,20.25 32.19,20.25 32.03,20.41 32.03,22.11 31.81,22.33 30.12,22.33 30.09,22.35 | 38.61,20.25 39.55,20.25 40.09,20.79 IC3.8 40.09,22.06 40.36,22.33 41.81,22.33 41.97,22.17 41.97,20.13 41.51,19.67 41.51,18.78 41.89,18.39 42.99,18.39 C23.1 | IC6.2 31.5,29.46 31.88,29.08 33.8,29.08 C31.1 34.18,27.92 34.51,27.59 34.51,25.83 34.35,25.67 32.19,25.67 32.03,25.83 32.03,27.53 31.81,27.75 29.65,27.75 29.49,27.59 29.49,24.33 30.09,23.73 30.09,22.35 | IC5.2 46.5,31.51 46.74,31.75 C36.1 53.72,36.56 53.72,48.12 53.88,48.28 65.44,48.28 66.21,49.05 T4.3 | v43.18,68.58 43.18,67.76 42.69,67.27 42.69,66.73 44.65,64.77 v47.5,64.77 | v13.21,68.07 13.21,67.1 T2.3 | C27.1 30.04,21.35 IC4.8 | C29.1 38.72,20.36 38.61,20.25
  other vias: 65.05,10.5 66.02,54.34 66.21,50.8 16.93,63.38 43.16,18.22
BAT+
  Top 1.27: POWER.2 S1.2
BOOT0  (via drill 0.35)
  Top 0.152: IC7.60 35.75,12.78 v35.81,12.78
  Bottom 0.152: v35.81,12.78 35.89,12.78 35.95,12.72 50.78,12.72 51.05,12.45 JP1.2
BOOT1  (via drill 0.35)
  Top 0.152: IC7.28 39.25,9.02 v39.37,9.14
  Bottom 0.152: v39.37,9.14 47.5,9.14 JP2.1
DIST1_ON
  Top 0.152: IC7.56 37.75,20.73 37.9,20.88 41.4,20.88 42.37,21.85 42.37,43.66 48.49,49.78 R5.1
DIST2_ON  (via drill 0.35)
  Top 0.152: IC7.57 37.25,20.99 37.44,21.18 37.85,21.18 41.27,21.18 42.06,21.97 42.06,43.79 48.36,50.09 61.77,50.09 62.36,50.67 64.64,50.67 65.02,51.05 v65.02,53.09 | v66.87,53.09 66.95,53.17 R4.1
  Bottom 0.152: v65.02,53.09 v66.87,53.09
DIST3_ON
  Top 0.152: IC7.58 36.75,21.26 36.98,21.49 41.15,21.49 41.76,22.1 41.76,43.95 48.18,50.37 48.18,62.82 48.6,63.25 50.29,63.25 50.8,63.75 R2.1
DIST4_ON
  Top 0.152: IC7.59 36.25,21.52 36.52,21.79 41.02,21.79 41.45,22.23 41.45,43.64 40.89,44.2 31.5,44.2 18.05,57.64 R3.1
DIST5_ON
  Top 0.152: IC7.61 35.25,21.79 35.56,22.1 40.89,22.1 41.15,22.35 41.15,43.43 40.69,43.89 31.29,43.89 18.54,56.64 R7.1
GND  (via drill 0.35)
  Top 0.254: C19.2 18.77,6 S2.A2 | U$10.GND v72.38,45.73 v72.39,45.72
  Top 1.27: POWER.1 55.73,9.72 C3.- C7.-
  Bottom 0.254: U$8.GND 8.9,62.75 8.89,62.74 | U$11.GND 3,48.05 3.05,48.01 3.3,48.26 3.05,48.26 2.79,48.01 | U$7.GND 38.27,66.89 38.35,66.8
  other vias: 8.9,62.9 3,48.27 38.27,67 66.9,61.1 12.95,60.2 57.66,59.94 50.55,48.51 69.6,11.43 69.34,52.83 72.39,58.17 1.78,55.63 3.3,59.44 9.14,65.53 11.43,68.07 65.28,65.02 69.6,60.71 59.94,67.56 35.81,10.92 33.78,9.4 26.92,36.58 26.92,35.31 26.92,34.04 28.19,34.04 28.19,35.31 28.19,36.58 29.46,36.58 29.46,35.31 29.46,34.04 45.72,34.04 45.72,35.31 45.72,36.58 46.99,36.58 46.99,35.31 46.99,34.04 48.26,34.04 48.26,35.31 48.26,36.58 32.51,22.86 44.96,17.02 44.96,16 44.96,14.99 58.67,21.08 59.94,21.08 60.96,21.08 62.23,21.08 63.25,21.08 65.02,21.08 66.29,21.08
  pour Top (rank 6): -2,-2 -2,72 76,72 76,-2
  pour Bottom: -1,-1 -1,71 75,71 75,-1
I_MOT1  (via drill 0.35)
  Top 0.152: IC7.27 38.75,17.67 v38.86,17.78
  Bottom 0.152: IC3.7 41.37,20.03 41.15,19.81 38.86,19.81 38.61,19.56 38.61,18.03 v38.86,17.78
I_MOT2  (via drill 0.35)
  Top 0.152: v37.85,17.78 38.25,17.38 IC7.26
  Bottom 0.152: IC4.7 31.36,20.2 31.75,19.81 37.95,19.81 38.2,19.56 38.2,18.13 v37.85,17.78
MOT1_A
  Bottom 0.61: MOT1_A.1 39,32 41.15,32 43,32 43.5,31.5 IC5.5
MOT1_B
  Bottom 0.61: MOT1_B.1 39,38 42,38 42.5,38.5 IC5.7
MOT1_DIR  (via drill 0.35)
  Top 0.152: IC7.34 45.42,10.25 47.5,12.32 47.5,20.19 44.2,23.49 44.2,28.19 44.45,28.45 v45.72,28.45
  Bottom 0.152: v45.72,28.45 46.48,29.21 46.99,29.21 47.5,29.72 IC5.1
MOT1_EN  (via drill 0.35)
  Top 0.152: IC7.35 45.49,10.75 47.19,12.45 47.19,20.06 43.89,23.36 43.89,40.43 v44.6,41.15
  Bottom 0.152: v44.6,41.15 45.97,41.15 46.5,40.62 IC5.11
MOT1_ENCODER_A  (via drill 0.35)
  Top 0.152: IC7.55 38.25,20.22 38.61,20.57 42.16,20.57 v42.93,19.81 | U$14.B 69.9,35 69.34,35.56 69.34,48.26 69.09,48.51 53.85,48.51 53.59,48.26 53.59,21.8 51.05,19.25 51.05,18.14 v51.31,17.88
  Bottom 0.152: v42.93,19.81 47.75,19.81 49.43,18.14 51.05,18.14 v51.31,17.88
MOT1_ENCODER_B  (via drill 0.35)
  Top 0.152: IC7.50 40.75,20.18 40.84,20.27 41.71,20.27 42.16,19.81 v42.16,19.05 | U$14.A 69.92,36 69.65,36.27 69.65,48.39 69.21,48.82 53.72,48.82 53.29,48.39 53.29,21.92 50.7,19.33 50.7,17.58 v51.31,16.98
  Bottom 0.152: v42.16,19.05 43.18,19.05 43.64,19.51 47.63,19.51 49.3,17.83 50.45,17.83 v51.31,16.98
MOT1_PWM  (via drill 0.35)
  Top 0.152: IC7.37 45.63,11.75 46.58,12.7 46.58,19.81 43.28,23.11 43.28,41.15 43.99,41.85 v43.99,43.14
  Bottom 0.152: IC5.12 47.5,40.36 47.32,40.36 46.23,41.45 45.16,41.45 44.86,41.76 44.35,41.76 43.99,42.12 v43.99,43.14
MOT1_VS
  Bottom 0.61: IC3.3 IC3.4 43.91,27.91 44.5,28.5 IC5.4
MOT2_A
  Bottom 0.61: IC6.5 28.5,31.5 29,32 35,32 MOT2_A.1
MOT2_B
  Bottom 0.61: IC6.7 27.5,38.5 28,38 35,38 MOT2_B.1
MOT2_DIR  (via drill 0.35)
  Top 0.152: IC7.39 45.07,12.75 45.09,12.72 45.74,12.72 45.97,12.95 45.97,19.56 42.67,22.86 42.67,41.86 v42.97,42.16 | v33.27,30.73 24.38,30.73 24.13,30.99 24.13,39.88 24.62,40.37 26.5,40.37 27.79,41.66 v33.27,41.66
  Bottom 0.152: v42.97,42.16 33.53,42.16 33.27,41.91 v33.27,41.66 | v33.27,30.73 33.27,30.48 33.02,30.23 32.57,30.23 IC6.1
MOT2_EN  (via drill 0.35)
  Top 0.152: IC7.36 45.56,11.25 46.89,12.57 46.89,19.94 43.59,23.24 43.59,40.89 43.59,41.02 44.59,42.03 44.59,43.39 44.24,43.74 43.7,43.74 v43.5,43.94
  Bottom 0.152: IC6.11 31.5,40.39 32.2,41.09 32.2,41.87 33.1,42.77 41.71,42.77 42.72,43.79 43.35,43.79 v43.5,43.94
MOT2_ENCODER_A  (via drill 0.35)
  Top 0.152: IC7.14 30.87,10.75 v30.03,9.91 | U$13.B 2.05,35.05 3.56,35.05 3.81,34.8 3.81,20.07 3.81,19.81 3.81,19.56 v4.32,19.05
  Bottom 0.152: v30.03,9.91 30.03,9.96 29.43,10.56 29.43,10.99 29.13,11.29 18.48,11.29 17.27,10.08 13.29,10.08 v4.32,19.05
MOT2_ENCODER_B  (via drill 0.35)
  Top 0.152: v29.97,9 30.27,9.3 30.28,9.3 30.63,9.65 30.63,9.83 31.05,10.25 IC7.15 | U$13.A 3.34,34 3.5,33.83 3.5,19.15 v3.41,19.05
  Bottom 0.152: v29.97,9 29.42,9.55 29.42,10.14 29.12,10.44 29.12,10.86 29,10.98 18.61,10.98 17.4,9.78 13.16,9.78 4.49,18.44 4.07,18.44 3.46,19.05 v3.41,19.05
MOT2_PWM  (via drill 0.35)
  Top 0.152: IC7.38 45.7,12.25 46.28,12.83 46.28,19.68 42.98,22.99 42.98,41.31 43.58,41.91 43.58,42.57 v42.97,43.18
  Bottom 0.152: v42.97,43.18 42.93,43.18 42.22,42.47 33.23,42.47 32.5,41.74 IC6.12
MOT2_VS
  Bottom 0.61: IC6.4 29.5,29 30,28.5 32,28.5 32.63,27.86 IC4.3 IC4.4
N$2
  Top 0.152: R2.2 T1.1
N$3
  Top 0.152: R3.2 16.05,65.91 T2.1
N$4
  Top 0.152: R4.2 T3.1
N$5
  Top 0.152: R5.2 64.67,49.85 T4.1
N$6
  Top 0.152: R7.2 6.26,55.56 T5.1
N$7
  Top 0.203: R6.1 61.4,2.96 LED5.A
N$8  (via drill 0.35)
  Bottom 0.152: U$8.VIN 14.7,64.28 T2.2
  other vias: 12.49,66.49 14.7,64.26
N$9  (via drill 0.35)
  Bottom 0.152: U$7.VIN 45.29,67 45.33,66.96 47.38,66.96 T1.2
  other vias: 47.56,67.14 43.35,67
N$11  (via drill 0.35)
  Bottom 0.152: T3.2 69.55,56.57 U$9.VIN
  other vias: 66.91,56.57 70.49,57.51
N$12  (via drill 0.35)
  Bottom 0.152: T4.2 69.34,50.82 69.34,41.04 69.73,40.65 U$10.VIN
  other vias: 68.41,51.75 71,40.65
N$13  (via drill 0.35)
  Bottom 0.152: U$11.VIN 6.46,53.35 T5.2
  other vias: 3,53.35 6.52,53.41
NRST  (via drill 0.35)  (1 unrouted)
  Top 0.152: IC7.7 30,14.25 29.43,13.68 29.43,10.16 29,9.73 28.25,9.73 28.19,9.68 | 23.25,6.1 S2.B2
  Top 0.254: 28.19,9.68 28.19,7.85 R8.1 27.18,6.84 27.18,6.35 26.85,6.03 S2.B2 | 23.18,6.03 | 23.18,6.03 23.25,6.1 | C19.1 21.9,6.03 23.18,6.03 | v21.59,14.48 22.09,13.97 S2.B1
  Bottom 0.254: PROG-SWDIO.6 19.08,14.48 v21.59,14.48
RCC_OSC_IN
  Top 0.152: 26.43,16.27 Y1.3
  Top 0.254: IC7.5 29.45,15.25 29.2,15 27.94,15 27.7,15.24 27.7,15.73 27.43,16 26.7,16 26.43,16.27 | Y1.3 26.62,16.62 C8.2
RCC_OSC_OUT
  Top 0.152: 28.5,10.62 C9.2
  Top 0.254: IC7.6 29.52,14.75 28.65,13.88 Y1.1 28.65,10.78 28.5,10.62
SCL  (via drill 0.35)
  Top 0.152: R24.1 50.09,15.87 50.09,19.59 52.68,22.17 52.68,48.57 v52.07,49.18 | IC7.41 44.48,13.75 v44.7,13.97 | v47.5,61.98 v47.49,61.98 46.74,62.73 46.15,62.73 45.58,63.3 45.58,65.28
  Top 0.254: U$11.SCL 1.22,45.73 1.02,45.94 1.02,51.82 1.27,52.07 4.06,52.07 4.32,52.32 4.32,55.12 3.46,55.97 3.39,55.97 1.52,57.84 1.52,58.86 5.49,62.83 | 44.55,68.68 44.52,68.65 44.52,66 44.35,65.83 42.34,65.83 42.16,66.01 42.16,68.83 42.06,68.94 35.81,68.94 | U$10.SCL 72.63,48.27 72.64,48.26 73,48.62 73,55.52 72.64,55.88 70.47,55.88 68.95,57.39 68.95,57.78 70.87,59.69 70.87,60.64 66.9,64.61 | 5.49,62.83 9.72,67.06 10.16,67.06 12.45,64.77 12.7,64.77 14.22,66.29 14.22,68.58 14.58,68.94 35.81,68.94 | 66.9,64.61 62.57,68.94 44.81,68.94 44.55,68.68 | U$9.SCL 66.81,64.61 66.9,64.61 | U$8.SCL 5.49,62.71 5.49,62.83 | U$7.SCL 35.73,68.85 35.81,68.94 | 44.55,68.68 v44.44,68.68 | v45.58,67.56 45.58,65.28
  Bottom 0.152: R24.1 50.59,14.31 50.24,13.97 v44.7,13.97 | v52.07,49.18 52.58,49.69 52.58,61.72 52.32,61.98 v47.5,61.98
  Bottom 0.254: v44.44,68.68 45.56,67.56 v45.58,67.56
  other vias: 50.59,15.37
SDA  (via drill 0.35)
  Top 0.152: IC7.40 45.27,13.25 v45.35,13.33 | 46.01,65.53 46.01,63.31 46.28,63.04 v47.29,63.04 | v53.19,49.17 52.98,48.97 52.98,22.05 50.4,19.46 50.4,16.66 50.8,16.26 51.23,16.26 R23.1
  Top 0.254: U$11.SDA 4.17,44.36 4.17,46.73 4,46.9 1.62,46.9 1.42,47.09 1.42,49.43 1.52,49.53 4.06,49.53 5.05,50.51 5.05,59.05 U$8.SDA 6.96,59.31 8.64,60.99 8.64,61.22 7.36,62.49 7.36,63.01 8.78,64.44 9.22,64.44 10.5,63.16 10.81,63.16 12.02,64.36 12.87,64.36 14.73,66.23 14.73,68.28 14.88,68.43 31.75,68.43 33.18,67 U$7.SDA 34.4,65.79 36.69,65.79 37.1,66.2 37.1,68 37.27,68.17 39.27,68.17 39.64,67.8 39.64,66 39.8,65.83 41.77,65.83 42.22,65.38 44.48,65.38 44.92,65.83 44.92,68.24 45.21,68.53 46.23,68.53 | 46.23,68.53 62.4,68.53 63.43,67.5 63.43,64.82 U$9.SDA 63.31,63.04 65.13,61.21 65.28,61.21 66.8,62.74 67.06,62.74 68.44,61.36 68.44,60.99 67.16,59.71 67.16,59.19 68.55,57.8 68.55,57.23 70.3,55.47 72.24,55.47 72.59,55.12 72.59,52.4 U$10.SDA | 46.01,65.53 46.01,67.06 46.24,67.29 46.24,68.52 46.23,68.53
  Bottom 0.152: v45.35,13.33 50.03,13.33 R23.1 | v47.29,63.04 48.05,62.28 52.45,62.28 52.88,61.85 52.88,49.47 v53.19,49.17
  other vias: 52.1,15.39
SW_1  (via drill 0.35)
  Top 0.152: IC7.8 30.36,13.75 v30.15,13.54 | v17.27,13.72 16.67,13.11 14.99,13.11 14.58,13.52 14.1,13.52 11.11,16.5 9.41,16.5 S3.8 7.89,14.99 7.3,14.99 R25.1
  Bottom 0.152: v30.15,13.54 29.84,13.24 29.78,13.24 29.05,12.51 18.48,12.51 v17.27,13.72
SW_2  (via drill 0.35)
  Top 0.152: IC7.9 30.71,13.25 30.4,12.93 30.34,12.93 v30.04,12.63 | v17.27,12.81 14.8,12.81 14.39,13.21 13.97,13.21 12.48,14.71 11.2,14.71 S3.7 7.93,11.43 6.28,11.43 R26.1
  Bottom 0.152: v30.04,12.63 29.61,12.2 17.88,12.2 v17.27,12.81
SW_3  (via drill 0.35)
  Top 0.152: v30.04,11.72 30.8,12.48 30.8,12.49 31.05,12.75 IC7.10 | v17.27,11.9 15.28,11.9 14.27,12.91 13,12.91 S3.6 9.65,9.56 9.65,8.06 R27.1
  Bottom 0.152: v30.04,11.72 29.86,11.9 v17.27,11.9
SW_4  (via drill 0.35)
  Top 0.152: IC7.11 31.05,12.25 30.64,11.84 30.64,11.42 v30.04,10.81 | v17.27,10.99 14.67,10.99 S3.5 13.46,9.78 13.46,8.82 R28.1
  Bottom 0.152: v30.04,10.81 29.26,11.59 17.88,11.59 v17.27,10.99
SWCLK  (via drill 0.35)
  Top 0.152: v41.15,14.22 41.25,14.33 IC7.49
  Top 0.254: PROG-SWDIO.5 18.09,15.69 18.75,15.03 19.52,15.03 19.68,14.87 19.68,14.1 v20.07,13.72
  Bottom 0.152: v20.07,13.72 20.97,12.81 28.56,12.81 29.9,14.15 41.07,14.15 v41.15,14.22
SWDIO  (via drill 0.35)
  Top 0.152: v41.86,14.8 41.86,15.95 42.16,16.25 IC7.46
  Top 0.254: PROG-SWDIO.3 20.64,14.08 20.98,13.74 v20.98,13.72
  Bottom 0.152: v20.98,13.72 21.57,13.12 28.43,13.12 29.77,14.45 40.52,14.45 40.9,14.83 41.4,14.83 41.43,14.8 v41.86,14.8
V+  (via drill 0.35)
  Top 0.203: S1.1 68.8,6.57 64.13,1.9 R6.2
  Top 0.254: C16.1 60.34,14.33 60.45,14.22
  Top 1.27: 58.05,14.22 C7.+ 55.99,19.56 | 58.05,14.22 C3.+ 58.05,10.28 59.53,8.8 S1.1 | U2.3 60.45,14.22 58.05,14.22 | 55.63,19.56 54.86,19.56 v54.1,20.32 | 55.99,19.56 55.63,19.56 | 55.63,19.56 v54.1,21.08 54.47,21.08 55.99,19.56 | 55.12,19.56 v54.1,19.56 | C34.+ 34.93,24.13 v35.56,24.13 v36.58,24.13 v37.85,24.13 v38.86,24.13 39.57,24.13 C32.+
  Bottom 0.61: IC4.2 30.73,26.71 IC4.1 | IC3.1 40.64,26.71 IC3.2
  Bottom 1.27: 40.89,24.13 43.94,24.13 46.48,21.59 48.01,21.59 50.04,19.56 52.58,19.56 | 40.89,24.13 v38.86,24.13 v37.85,24.13 v36.58,24.13 v35.56,24.13 30.99,24.13 30.73,24.38 30.73,26.71 | 40.64,26.71 40.64,24.38 40.89,24.13 | 52.58,19.56 v54.1,19.56 v54.1,21.08 52.58,19.56
VDDA
  Top 0.254: L2.2 30.52,7.8 C21.1 30.73,8.63 31.42,9.32 32.62,9.32 32.78,9.48 32.78,11.02 32.55,11.25 IC7.13

### Text on the board
tNames: GND | +